# EAGLE design TelosDebugBoard (EAGLE 5.10)
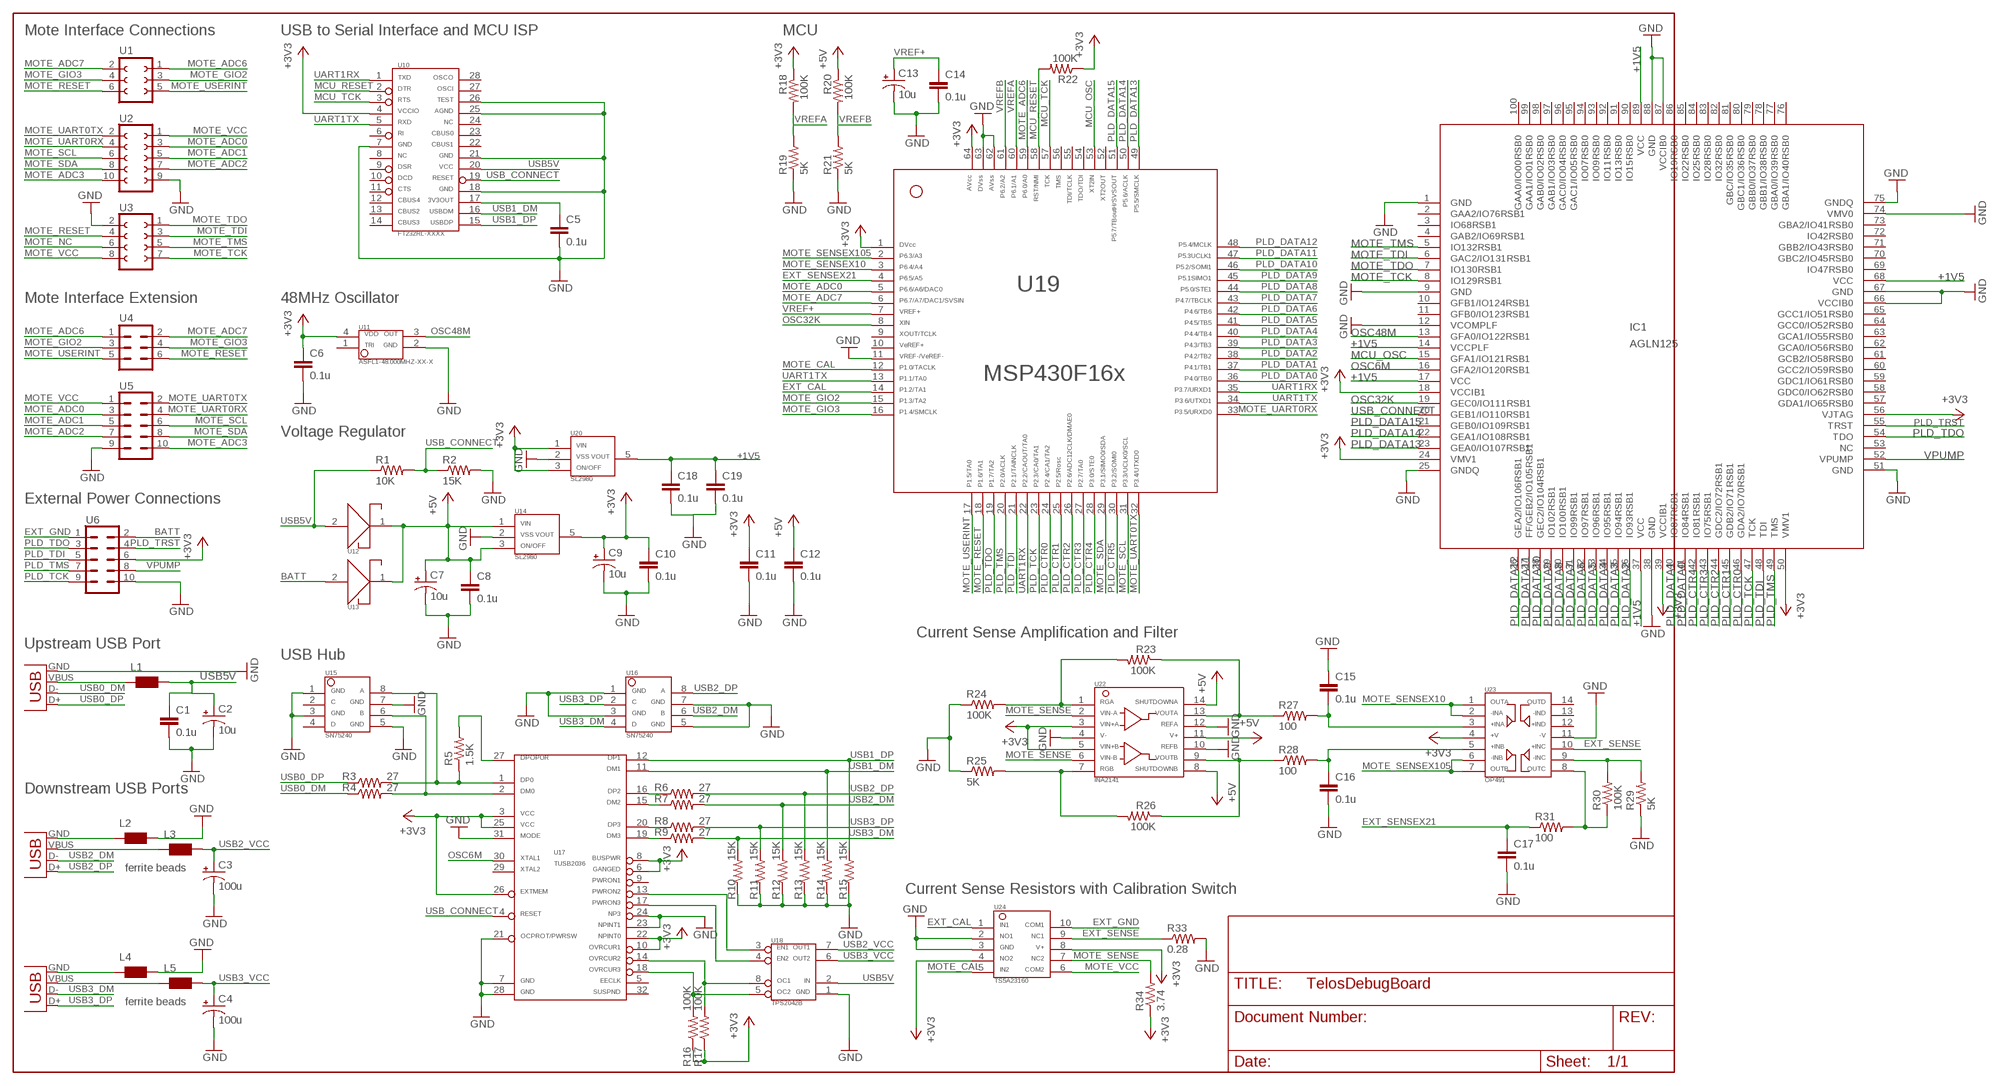
[diagram p0: schematic, sheet 1]

## Parts
C1  0.1u  C-EUC0603  [C0603]
C2  10u  CPOL-USCT6032  [CT6032]
C3  100u  CPOL-USCT7343  [CT7343]
C4  100u  CPOL-USCT7343  [CT7343]
C5  0.1u  C-EUC0603  [C0603]
C6  0.1u  C-EUC0603  [C0603]
C7  10u  CPOL-USCT6032  [CT6032]
C8  0.1u  C-EUC0603  [C0603]
C9  10u  CPOL-USCT6032  [CT6032]
C10  0.1u  C-EUC0603  [C0603]
C11  0.1u  C-EUC0603  [C0603]
C12  0.1u  C-EUC0603  [C0603]
C13  10u  CPOL-USCT6032  [CT6032]
C14  0.1u  C-EUC0603  [C0603]
C15  0.1u  C-EUC0603  [C0603]
C16  0.1u  C-EUC0603  [C0603]
C17  0.1u  C-EUC0603  [C0603]
C18  0.1u  C-EUC0603  [C0603]
C19  0.1u  C-EUC0603  [C0603]
IC1  AGLN125  [VQ100]
L1  WE-CBF_0805  [0805]
L2  WE-CBF_0805  [0805]
L3  WE-CBF_0805  [0805]
L4  WE-CBF_0805  [0805]
L5  WE-CBF_0805  [0805]
R1  10K  R-US_R0603  [R0603]
R2  15K  R-US_R0402  [R0402]
R3  27  R-US_R0402  [R0402]
R4  27  R-US_R0402  [R0402]
R5  1.5K  R-US_R0402  [R0402]
R6  27  R-US_R0402  [R0402]
R7  27  R-US_R0402  [R0402]
R8  27  R-US_R0402  [R0402]
R9  27  R-US_R0402  [R0402]
R10  15K  R-US_R0402  [R0402]
R11  15K  R-US_R0402  [R0402]
R12  15K  R-US_R0402  [R0402]
R13  15K  R-US_R0402  [R0402]
R14  15K  R-US_R0402  [R0402]
R15  15K  R-US_R0402  [R0402]
R16  100K  R-US_R0603  [R0603]
R17  100K  R-US_R0603  [R0603]
R18  100K  R-US_R0603  [R0603]
R19  5K  R-US_R0603  [R0603]
R20  100K  R-US_R0603  [R0603]
R21  5K  R-US_R0603  [R0603]
R22  100K  R-US_R0603  [R0603]
R23  100K  R-US_R0603  [R0603]
R24  100K  R-US_R0603  [R0603]
R25  5K  R-US_R0603  [R0603]
R26  100K  R-US_R0603  [R0603]
R27  100  R-US_R0402  [R0402]
R28  100  R-US_R0402  [R0402]
R29  5K  R-US_R0603  [R0603]
R30  100K  R-US_R0603  [R0603]
R31  100  R-US_R0402  [R0402]
R33  0.28  R-US_R0805  [R0805]
R34  3.74  R-US_R1206  [R1206]
U1  HEADER-3X2-RECEPTICAL  [HEADER-3X2-RECEPTICAL]
U2  HEADER-5X2-RECEPTICAL  [HEADER-5X2-RECEPTICAL]
U3  HEADER-4X2-RECEPTICAL  [HEADER-4X2-RECEPTICAL]
U4  HEADER-3X2-PLUG  [HEADER-3X2-PLUG]
U5  HEADER-5X2-PLUG  [HEADER-5X2-PLUG]
U6  HEADER-5X2-PLUG  [HEADER-5X2-PLUG]
U7  USB-TYPEA-PLUG  [USB-TYPEA-PLUG]
U8  USB-TYPEA-RECEPTICAL  [USB-TYPEA-RECEPTICAL]
U9  USB-TYPEA-RECEPTICAL  [USB-TYPEA-RECEPTICAL]
U10  FT2232RL  [SSOP28]
U11  ASFL1-48.000MHZ-EK-T  [ASFXX-XX.XXXMHZ-XX-X]
U12  PMEG2010AEH  [SOD123F]
U13  PMEG2010AEH  [SOD123F]
U14  SL2980  [SOT-23-5]
U15  SN75240PW  [PW8]
U16  SN75240PW  [PW8]
U17  TUSB2036VF  [VF32]
U18  TPS2042BD  [D8]
U19  MSP430  F16X---PM64  [PM/PAG64]
U20  SL2980  [SOT-23-5]
U22  INA2331  [PW14]
U23  OP491  OPT491  [TSSOP14]
U24  TS5A23160  [DGS10]

## Nets
+1V5: C18.1 C19.1 IC1.14(VCCPLF) IC1.17(VCC) IC1.37(VCC) IC1.68(VCC) IC1.89(VCC) U20.5
+3V3: C6.1 C9.+ C10.1 C11.1 IC1.18(VCCIB1) IC1.24(VMV1) IC1.39(VCCIB1) IC1.50(VMV1) IC1.56(VJTAG) R16.1 R17.1 R18.1 R22.1 R34.1 U6.6 U10.4 U11.4 U14.5 U17.3 U17.6 U17.8 U17.10 U17.22 U17.25 U17.26 U19.1 U19.64 U20.1 U20.3 U22.3 U22.5 U23.4 U24.4 U24.8
+5V: C7.+ C8.1 C12.1 R20.1 U12.1 U13.1 U14.1 U14.3 U22.8 U22.11 U22.14
BATT: U6.2 U13.2
EXT_CAL: U19.14 U24.1
EXT_GND: U6.1 U24.10
EXT_SENSE: R33.1 U23.10 U24.9
EXT_SENSEX21: C17.1 R31.1 U19.4
GND: C1.2 C2.- C3.- C4.- C5.2 C6.2 C7.- C8.2 C9.- C10.2 C11.2 C12.2 C13.- C14.2 C15.1 C16.2 C17.2 C18.2 C19.2 IC1.1(GND) IC1.9(GND) IC1.12(VCOMPLF) IC1.25(GNDQ) IC1.38(GND) IC1.51(GND) IC1.66(VCCIB0) IC1.67(GND) IC1.74(VMV0) IC1.75(GNDQ) IC1.87(VCCIB0) IC1.88(GND) L2.2 L4.2 R2.2 R10.1 R11.1 R12.1 R13.1 R14.1 R15.1 R19.1 R21.1 R24.1 R25.1 R29.1 R33.2 U2.9 U3.2 U5.9 U6.10 U7.GND U10.7 U10.18 U10.21 U10.25 U10.26 U11.2 U14.2 U15.1 U15.3 U15.5 U15.7 U16.1 U16.3 U16.5 U16.7 U17.7 U17.21 U17.23 U17.24 U17.28 U17.31 U18.1 U19.11 U19.62 U19.63 U20.2 U22.4 U22.10 U22.12 U23.11 U24.2 U24.3
MCU_OSC: IC1.15(GFA1/IO121RSB1) U19.53
MCU_RESET: R22.2 U10.2 U19.58
MCU_TCK: U10.3 U19.57
MOTE_ADC0: U2.3 U5.3 U19.5
MOTE_ADC1: U2.5 U5.5
MOTE_ADC2: U2.7 U5.7
MOTE_ADC3: U2.10 U5.10
MOTE_ADC6: U1.1 U4.1 U19.59
MOTE_ADC7: U1.2 U4.2 U19.6
MOTE_CAL: U19.12 U24.5
MOTE_GIO2: U1.3 U4.3 U19.15
MOTE_GIO3: U1.4 U4.4 U19.16
MOTE_NC: U3.6
MOTE_RESET: U1.6 U3.4 U4.6 U19.18
MOTE_SCL: U2.6 U5.6 U19.31
MOTE_SDA: U2.8 U5.8 U19.29
MOTE_SENSE: R34.2 U22.2 U22.6 U24.7
MOTE_SENSEX10: U19.3 U23.1 U23.2
MOTE_SENSEX105: U19.2 U23.6 U23.7
MOTE_TCK: IC1.8(IO129RSB1) U3.7
MOTE_TDI: IC1.6(GAC2/IO131RSB1) U3.3
MOTE_TDO: IC1.7(IO130RSB1) U3.1
MOTE_TMS: IC1.5(IO132RSB1) U3.5
MOTE_UART0RX: U2.4 U5.4 U19.33
MOTE_UART0TX: U2.2 U5.2 U19.32
MOTE_USERINT: U1.5 U4.5 U19.17
MOTE_VCC: U2.1 U3.8 U5.1 U24.6
N$1: C5.1 U10.17
N$2: L1.1 U7.VBUS
N$4: L2.1 U8.GND
N$5: L3.1 U8.VBUS
N$6: L4.1 U9.GND
N$7: U17.13 U18.3
N$8: L5.1 U9.VBUS
N$11: U17.17 U18.4
N$12: R17.2 U17.14 U18.8
N$13: R16.2 U17.18 U18.5
N$20: R5.2 U17.27
N$21: R3.2 R5.1 U15.8 U17.1
N$22: R25.2 R26.2 U22.7
N$23: R23.2 R24.2 U22.1
N$24: R29.2 R30.2 U23.9
N$25: R30.1 R31.2 U23.8
N$26: R4.2 U15.6 U17.2
N$27: C15.2 R27.2 U23.3
N$28: C16.1 R28.2 U23.5
N$29: R6.1 U17.16
N$30: R7.1 U17.15
N$31: R8.1 U17.20
N$32: R9.1 U17.19
OSC6M: IC1.16(GFA2/IO120RSB1) U17.30
OSC32K: IC1.19(GEC0/IO111RSB1) U19.8
OSC48M: IC1.13(GFA0/IO122RSB1) U11.3
PLD_CTR0: IC1.46(GDA2/IO70RSB1) U19.24
PLD_CTR1: IC1.45(GDB2/IO71RSB1) U19.25
PLD_CTR2: IC1.44(GDC2/IO72RSB1) U19.26
PLD_CTR3: IC1.43(IO75RSB1) U19.27
PLD_CTR4: IC1.42(IO81RSB1) U19.28
PLD_CTR5: U19.30
PLD_DATA0: IC1.41(IO84RSB1) U19.36
PLD_DATA1: IC1.40(IO87RSB1) U19.37
PLD_DATA2: IC1.36(IO93RSB1) U19.38
PLD_DATA3: IC1.35(IO94RSB1) U19.39
PLD_DATA4: IC1.34(IO95RSB1) U19.40
PLD_DATA5: IC1.33(IO96RSB1) U19.41
PLD_DATA6: IC1.32(IO97RSB1) U19.42
PLD_DATA7: IC1.31(IO99RSB1) U19.43
PLD_DATA8: IC1.30(IO100RSB1) U19.44
PLD_DATA9: IC1.29(IO102RSB1) U19.45
PLD_DATA10: IC1.28(GEC2/IO104RSB1) U19.46
PLD_DATA11: IC1.27(FF/GEB2/IO105RSB1) U19.47
PLD_DATA12: IC1.26(GEA2/IO106RSB1) U19.48
PLD_DATA13: IC1.23(GEA0/IO107RSB1) U19.49
PLD_DATA14: IC1.22(GEA1/IO108RSB1) U19.50
PLD_DATA15: IC1.21(GEB0/IO109RSB1) U19.51
PLD_TCK: IC1.47(TCK) U6.9 U19.23
PLD_TDI: IC1.48(TDI) U6.5 U19.21
PLD_TDO: IC1.54(TDO) U6.3 U19.19
PLD_TMS: IC1.49(TMS) U6.7 U19.20
PLD_TRST: IC1.55(TRST) U6.4
UART1RX: U10.1 U19.22 U19.35
UART1TX: U10.5 U19.13 U19.34
USB0_DM: R4.1 U7.D-
USB0_DP: R3.1 U7.D+
USB1_DM: R14.2 U10.16 U17.11
USB1_DP: R15.2 U10.15 U17.12
USB2_DM: R7.2 R12.2 U8.D- U16.6
USB2_DP: R6.2 R13.2 U8.D+ U16.8
USB2_VCC: C3.+ L3.2 U18.7
USB3_DM: R9.2 R10.2 U9.D- U16.4
USB3_DP: R8.2 R11.2 U9.D+ U16.2
USB3_VCC: C4.+ L5.2 U18.6
USB5V: C1.1 C2.+ L1.2 R1.1 U10.20 U12.2 U18.2
USB_CONNECT: IC1.20(GEB1/IO110RSB1) R1.2 R2.1 U10.19 U17.4
VOUTA: R23.1 R27.1 U22.13
VOUTB: R26.1 R28.1 U22.9
VPUMP: IC1.52(VPUMP) U6.8
VREF+: C13.+ C14.1 U19.7
VREFA: R18.2 R19.2 U19.60
VREFB: R20.2 R21.2 U19.61
Unconnected: IC1.2(GAA2/IO76RSB1) IC1.3(IO68RSB1) IC1.4(GAB2/IO69RSB1) IC1.10(GFB1/IO124RSB1) IC1.11(GFB0/IO123RSB1) IC1.53(NC) IC1.57(GDA1/IO65RSB0) IC1.58(GDC0/IO62RSB0) IC1.59(GDC1/IO61RSB0) IC1.60(GCC2/IO59RSB0) IC1.62(GCA0/IO56RSB0) IC1.64(GCC0/IO52RSB0) IC1.65(GCC1/IO51RSB0) IC1.69(IO47RSB0) IC1.70(GBC2/IO45RSB0) IC1.71(GBB2/IO43RSB0) IC1.72(IO42RSB0) IC1.73(GBA2/IO41RSB0) IC1.76(GBA1/IO40RSB0) IC1.77(GBA0/IO39RSB0) IC1.78(GBB1/IO38RSB0) IC1.79(GBB0/IO37RSB0) IC1.80(GBC1/IO36RSB0) IC1.81(GBC/IO35RSB0) IC1.82(IO32RSB0) IC1.83(IO28RSB0) IC1.84(IO25RSB0) IC1.85(IO22RSB0) IC1.86(IO19RSB0) IC1.90(IO15RSB0) IC1.91(IO13RSB0) IC1.92(IO11RSB0) IC1.93(IO09RSB0) IC1.94(IO07RSB0) IC1.95(GAC1/IO05RSB0) IC1.96(GAC0/IO04RSB0) IC1.97(GAB1/IO03RSB0) IC1.98(GAB0/IO02RSB0) IC1.99(GAA1/IO01RSB0) IC1.100(GAA0/IO00RSB0) U10.6 U10.8 U10.9 U10.10 U10.11 U10.12 U10.13 U10.14 U10.22 U10.23 U10.24 U10.27 U10.28 U11.1 U15.2 U15.4 U17.5 U17.9 U17.29 U17.32 U19.9 U19.10 U19.52 U19.54 U19.55 U19.56 U23.12 U23.13 U23.14

## Notes on the sheet
- Mote Interface Connections | USB to Serial Interface and MCU ISP | MCU
- Mote Interface Extension | 48MHz Oscillator
- Voltage Regulator
- External Power Connections
- Current Sense Amplification and Filter
- Upstream USB Port
- USB Hub
- Downstream USB Ports
- ferrite beads
- Current Sense Resistors with Calibration Switch
- ferrite beads

## Power pins joined to a net without a drawn wire
GCA1/IO55RSB0: IC1.63(GCA1/IO55RSB0)
GCB2/IO58RSB0: IC1.61(GCB2/IO58RSB0)

## Library data of the parts
C1 C5 C6 C8 C10-C12 C14-C19 = rcl:C-EU: CAPACITOR, European symbol
C2-C4 C7 C9 C13 = rcl:CPOL-US: POLARIZED CAPACITOR, American symbol
IC1 = MATT_ACTEL:AGLN125: Igloo nano FPGA from Actel.
L1-L5 = wuerth-elektronik:WE-CBF: SMD EMI Suppression Ferrite Beads - excellent anti-EMI properties - low DCR - impedances till 3000 ohms - rated current up to 6 A
R1-R31 R33 R34 = resistor:R-US_: RESISTOR, American symbol
U1 = TDB:HEADER-3X2-RECEPTICAL
U2 = TDB:HEADER-5X2-RECEPTICAL: FEMALE HEADER
U3 = TDB:HEADER-4X2-RECEPTICAL: Header receptical 2mm spacing
U4 = TDB:HEADER-3X2-PLUG: PIN HEADER
U5 U6 = TDB:HEADER-5X2-PLUG: PIN HEADER
U7 = TDB:USB-TYPEA-PLUG
U8 U9 = TDB:USB-TYPEA-RECEPTICAL
U10 = TDBRevC:FT2232RL: Future Technology Devices (FTDI) FT232RL USB UART IC. In SSOP28 packege.
U11 = TDBRevC:ASFL1-48.000MHZ-EK-T: 48MHz crystal clock oscillator.
U12 U13 = TDBRevC:PMEG2010AEH: Schottky diode/rectifier.
U14 U20 = TDB:SL2980: LDO voltage regulator
U15 U16 = TDB:SN75240PW: USB port transient suppressor
U17 = TDB:TUSB2036VF: USB hub
U18 = TDB:TPS2042BD: Current-limited, power-distribution switch for USB
U19 = TI_MSP430_v13:F16X---PM64: *** MSP430F16x *** PM64
U22 = TDB:INA2331: Dual instumentation amplifier
U23 = TDB:OPT491: Quad op amp with input overvoltage protection
U24 = TDB:TS5A23160: TI: Dual SPDT analog switch.

## Board
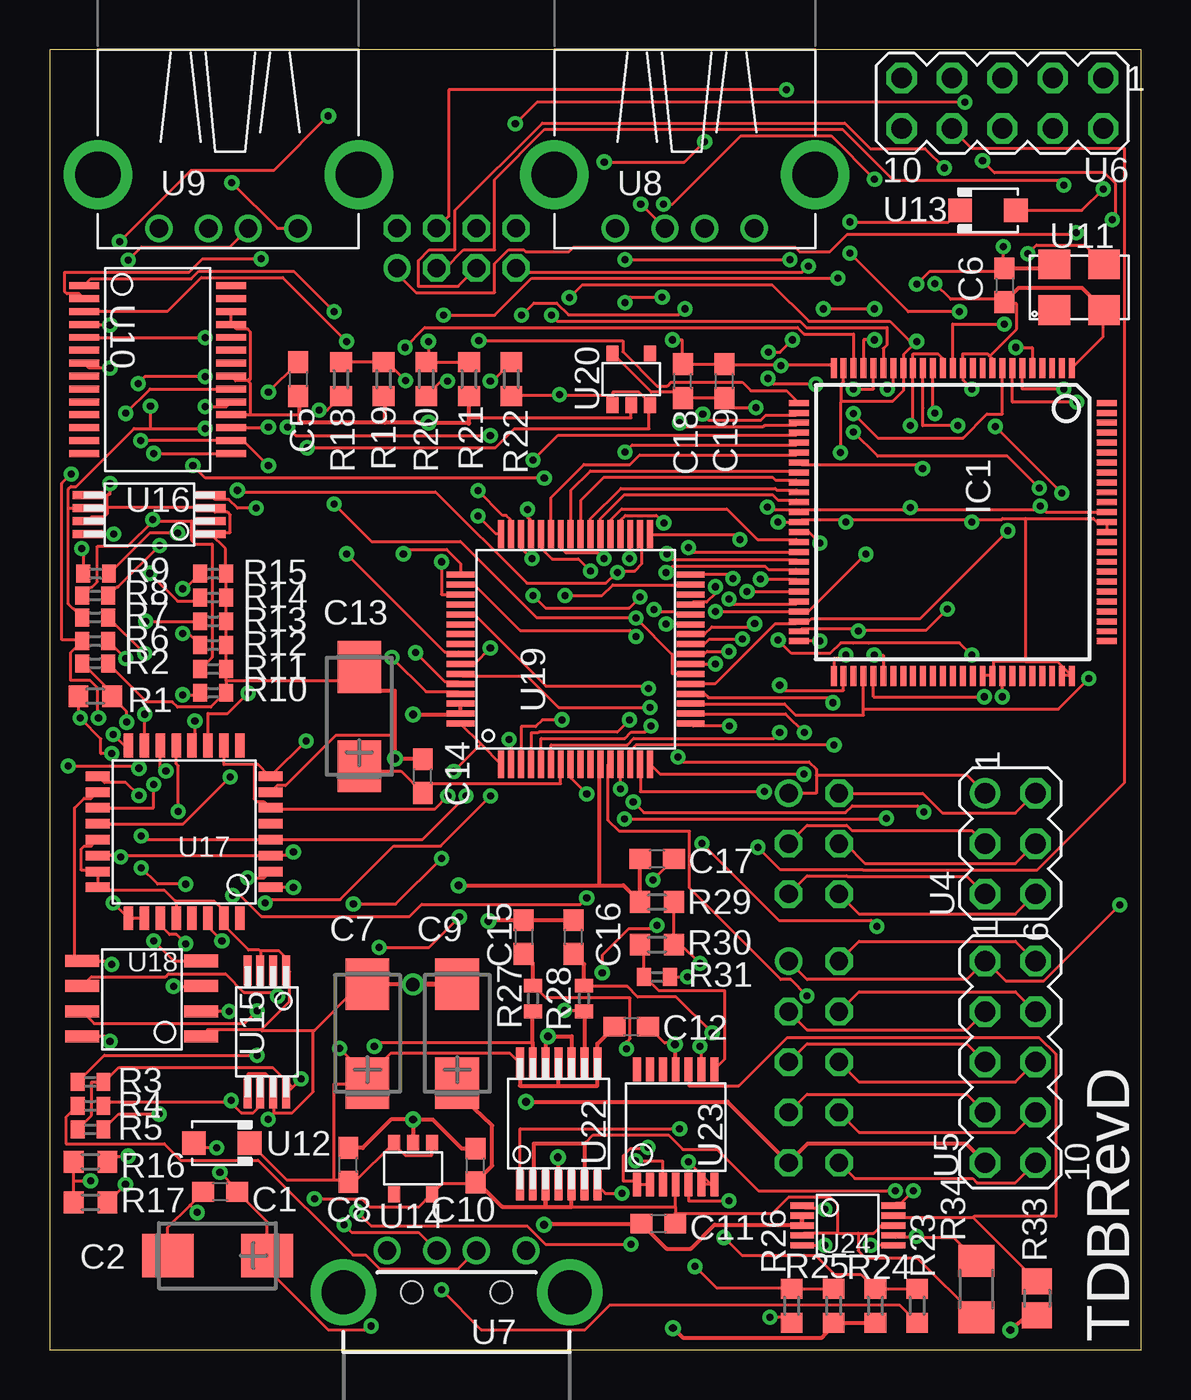
[diagram p1: board, top side]
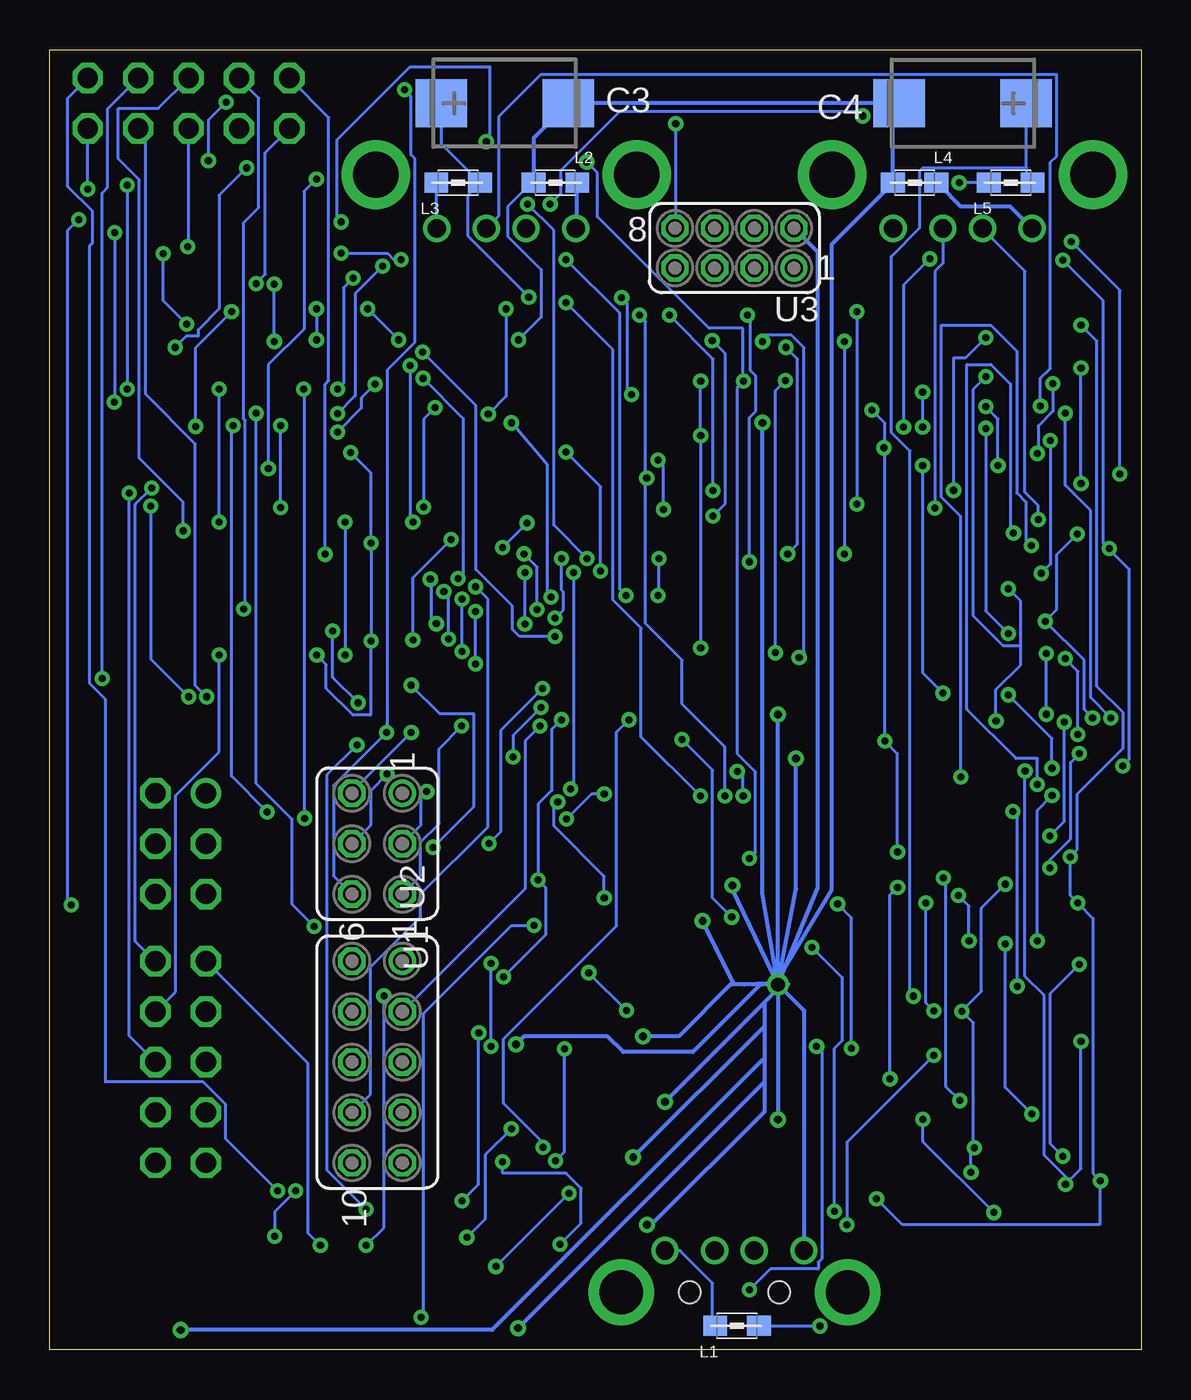
[diagram p2: board, bottom side, seen from below]

Size 55 x 65.5 mm. Coordinates in mm from the lower left corner, seen from the top.
Outline: 0,0 55,0 55,65.5 0,65.5 0,0
Copper layers (1*16): Top 0.0178mm / dielectric 1.4986mm / Bottom 0.0178mm
Design rules "SSC-EAGLE-2Lyr_v1.0.0.3": minimum track width 6mil, minimum drill 14mil, track to track 6mil, track to pad 6mil, pad to pad 6mil, via to via 6mil, smd to smd 6mil, copper to edge 20mil, drill to drill 16mil, minimum pad ring 8mil, minimum via ring 8mil, stop-mask expansion 3mil, vias tented up to drill 0mil, thermal gap 10mil

### Footprints (pad centres in the part's own frame; a part is rotated, then mirrored left to right if it is on the bottom)
C0603 = smd 1.1 x 1: 1 -0.85,0; 2 0.85,0
CT6032 = smd 2.6 x 2.2: + -2.5,0; - 2.5,0
CT7343 = smd 2.6 x 2.4: + -3.2,0; - 3.2,0
VQ100 = smd 1 x 0.3: 1 -7.75,6; 2 -7.75,5.5; 3 -7.75,5; 4 -7.75,4.5; 5 -7.75,4; 6 -7.75,3.5; 7 -7.75,3; 8 -7.75,2.5; 9 -7.75,2; 10 -7.75,1.5; 11 -7.75,1; 12 -7.75,0.5; 13 -7.75,0; 14 -7.75,-0.5; 15 -7.75,-1; 16 -7.75,-1.5; 17 -7.75,-2; 18 -7.75,-2.5; 19 -7.75,-3; 20 -7.75,-3.5; 21 -7.75,-4; 22 -7.75,-4.5; 23 -7.75,-5; 24 -7.75,-5.5; 25 -7.75,-6; 51 7.75,-6; 52 7.75,-5.5; 53 7.75,-5; 54 7.75,-4.5; 55 7.75,-4; 56 7.75,-3.5; 57 7.75,-3; 58 7.75,-2.5; 59 7.75,-2; 60 7.75,-1.5; 61 7.75,-1; 62 7.75,-0.5; 63 7.75,0; 64 7.75,0.5; 65 7.75,1; 66 7.75,1.5; 67 7.75,2; 68 7.75,2.5; 69 7.75,3; 70 7.75,3.5; 71 7.75,4; 72 7.75,4.5; 73 7.75,5; 74 7.75,5.5; 75 7.75,6 | smd 0.3 x 1: 26 -6,-7.75; 27 -5.5,-7.75; 28 -5,-7.75; 29 -4.5,-7.75; 30 -4,-7.75; 31 -3.5,-7.75; 32 -3,-7.75; 33 -2.5,-7.75; 34 -2,-7.75; 35 -1.5,-7.75; 36 -1,-7.75; 37 -0.5,-7.75; 38 0,-7.75; 39 0.5,-7.75; 40 1,-7.75; 41 1.5,-7.75; 42 2,-7.75; 43 2.5,-7.75; 44 3,-7.75; 45 3.5,-7.75; 46 4,-7.75; 47 4.5,-7.75; 48 5,-7.75; 49 5.5,-7.75; 50 6,-7.75; 76 6,7.75; 77 5.5,7.75; 78 5,7.75; 79 4.5,7.75; 80 4,7.75; 81 3.5,7.75; 82 3,7.75; 83 2.5,7.75; 84 2,7.75; 85 1.5,7.75; 86 1,7.75; 87 0.5,7.75; 88 0,7.75; 89 -0.5,7.75; 90 -1,7.75; 91 -1.5,7.75; 92 -2,7.75; 93 -2.5,7.75; 94 -3,7.75; 95 -3.5,7.75; 96 -4,7.75; 97 -4.5,7.75; 98 -5,7.75; 99 -5.5,7.75; 100 -6,7.75
0805 = smd 1.2 x 1: 1 -1.1,0; 2 1.1,0
R0603 = smd 1 x 1.1: 1 -0.85,0; 2 0.85,0
R0402 = smd 0.7 x 0.9: 1 -0.65,0; 2 0.65,0
R0805 = smd 1.3 x 1.5: 1 -0.85,0; 2 0.85,0
R1206 = smd 1.6 x 1.803: 1 -1.422,0; 2 1.422,0
HEADER-3X2-RECEPTICAL = drill 0.914 round: 1 -2.54,1.27 | drill 0.914 octagon: 2 -2.54,-1.27; 3 0,1.27; 4 0,-1.27; 5 2.54,1.27; 6 2.54,-1.27
HEADER-5X2-RECEPTICAL = drill 0.914 round: 1 -5.08,1.27 | drill 0.914 octagon: 2 -5.08,-1.27; 3 -2.54,1.27; 4 -2.54,-1.27; 5 0,1.27; 6 0,-1.27; 7 2.54,1.27; 8 2.54,-1.27; 9 5.08,1.27; 10 5.08,-1.27
HEADER-4X2-RECEPTICAL = drill 0.914 round: 1 -3,1 | drill 0.914 octagon: 2 -3,-1; 3 -1,1; 4 -1,-1; 5 1,1; 6 1,-1; 7 3,1; 8 3,-1
HEADER-3X2-PLUG = drill 1.016 round: 1 -2.54,-1.27 | drill 1.016 octagon: 2 -2.54,1.27; 3 0,-1.27; 4 0,1.27; 5 2.54,-1.27; 6 2.54,1.27
HEADER-5X2-PLUG = drill 1.016 octagon: 1 -5.08,-1.27; 2 -5.08,1.27; 3 -2.54,-1.27; 4 -2.54,1.27; 5 0,-1.27; 6 0,1.27; 7 2.54,-1.27; 8 2.54,1.27; 9 5.08,-1.27; 10 5.08,1.27
USB-TYPEA-PLUG = drill 0.92 round: D+ 2.1,1; D- 2.1,-1; GND 2.1,3.5; VBUS 2.1,-3.5 | drill 2.2 round: GND@1 0,5.7; GND@2 0,-5.7 | hole 1.1: 0,2.25; 0,-2.25
USB-TYPEA-RECEPTICAL = drill 0.92 round: D+ 2.71,-1; D- 2.71,1; GND 2.71,-3.5; VBUS 2.71,3.5 | drill 2.3 round: GND@1 0,6.57; GND@2 0,-6.57
SSOP28 = smd 1.5 x 0.35: 1 -3.7,4.225; 2 -3.7,3.575; 3 -3.7,2.925; 4 -3.7,2.275; 5 -3.7,1.625; 6 -3.7,0.975; 7 -3.7,0.325; 8 -3.7,-0.325; 9 -3.7,-0.975; 10 -3.7,-1.625; 11 -3.7,-2.275; 12 -3.7,-2.925; 13 -3.7,-3.575; 14 -3.7,-4.225; 15 3.7,-4.225; 16 3.7,-3.575; 17 3.7,-2.925; 18 3.7,-2.275; 19 3.7,-1.625; 20 3.7,-0.975; 21 3.7,-0.325; 22 3.7,0.325; 23 3.7,0.975; 24 3.7,1.625; 25 3.7,2.275; 26 3.7,2.925; 27 3.7,3.575; 28 3.7,4.225
ASFXX-XX.XXXMHZ-XX-X = smd 1.6 x 1.5: 1 -1.25,-1.15; 2 1.25,-1.15; 3 1.25,1.15; 4 -1.25,1.15
SOD123F = smd 1.2 x 1.2: 1 -1.4,0; 2 1.4,0
SOT-23-5 = smd 0.6 x 0.8: 1 -0.95,-1.3; 2 0,-1.3; 3 0.95,-1.3; 4 0.95,1.3; 5 -0.95,1.3
PW8 = smd 0.4 x 1.5: 1 -0.975,-3.1; 2 -0.325,-3.1; 3 0.325,-3.1; 4 0.975,-3.1; 5 0.975,3.1; 6 0.325,3.1; 7 -0.325,3.1; 8 -0.975,3.1
VF32 = smd 0.48 x 1.2: 1 -2.8,-4.35; 2 -2,-4.35; 3 -1.2,-4.35; 4 -0.4,-4.35; 5 0.4,-4.35; 6 1.2,-4.35; 7 2,-4.35; 8 2.8,-4.35; 17 2.8,4.35; 18 2,4.35; 19 1.2,4.35; 20 0.4,4.35; 21 -0.4,4.35; 22 -1.2,4.35; 23 -2,4.35; 24 -2.8,4.35 | smd 1.2 x 0.48: 9 4.35,-2.8; 10 4.35,-2; 11 4.35,-1.2; 12 4.35,-0.4; 13 4.35,0.4; 14 4.35,1.2; 15 4.35,2; 16 4.35,2.8; 25 -4.35,2.8; 26 -4.35,2; 27 -4.35,1.2; 28 -4.35,0.4; 29 -4.35,-0.4; 30 -4.35,-1.2; 31 -4.35,-2; 32 -4.35,-2.8
D8 = smd 0.6 x 1.7: 1 -1.905,-3; 2 -0.635,-3; 3 0.635,-3; 5 1.905,3; 6 0.635,3; 7 -0.635,3; 8 -1.905,3 | smd 0.66 x 1.7: 4 1.905,-3
PM/PAG64 = smd 1.4 x 0.3: 1 -5.8,3.75; 2 -5.8,3.25; 3 -5.8,2.75; 4 -5.8,2.25; 5 -5.8,1.75; 6 -5.8,1.25; 7 -5.8,0.75; 8 -5.8,0.25; 9 -5.8,-0.25; 10 -5.8,-0.75; 11 -5.8,-1.25; 12 -5.8,-1.75; 13 -5.8,-2.25; 14 -5.8,-2.75; 15 -5.8,-3.25; 16 -5.8,-3.75; 33 5.8,-3.75; 34 5.8,-3.25; 35 5.8,-2.75; 36 5.8,-2.25; 37 5.8,-1.75; 38 5.8,-1.25; 39 5.8,-0.75; 40 5.8,-0.25; 41 5.8,0.25; 42 5.8,0.75; 43 5.8,1.25; 44 5.8,1.75; 45 5.8,2.25; 46 5.8,2.75; 47 5.8,3.25; 48 5.8,3.75 | smd 0.3 x 1.4: 17 -3.75,-5.8; 18 -3.25,-5.8; 19 -2.75,-5.8; 20 -2.25,-5.8; 21 -1.75,-5.8; 22 -1.25,-5.8; 23 -0.75,-5.8; 24 -0.25,-5.8; 25 0.25,-5.8; 26 0.75,-5.8; 27 1.25,-5.8; 28 1.75,-5.8; 29 2.25,-5.8; 30 2.75,-5.8; 31 3.25,-5.8; 32 3.75,-5.8; 49 3.75,5.8; 50 3.25,5.8; 51 2.75,5.8; 52 2.25,5.8; 53 1.75,5.8; 54 1.25,5.8; 55 0.75,5.8; 56 0.25,5.8; 57 -0.25,5.8; 58 -0.75,5.8; 59 -1.25,5.8; 60 -1.75,5.8; 61 -2.25,5.8; 62 -2.75,5.8; 63 -3.25,5.8; 64 -3.75,5.8
PW14 = smd 0.4 x 1.5: 1 -1.95,-3.1; 2 -1.3,-3.1; 3 -0.65,-3.1; 4 0,-3.1; 5 0.65,-3.1; 6 1.3,-3.1; 7 1.95,-3.1; 8 1.95,3.1; 9 1.3,3.1; 10 0.65,3.1; 11 0,3.1; 12 -0.65,3.1; 13 -1.3,3.1; 14 -1.95,3.1
TSSOP14 = smd 0.4 x 1.2: 1 -1.95,-2.9; 2 -1.3,-2.9; 3 -0.65,-2.9; 4 0,-2.9; 5 0.65,-2.9; 6 1.3,-2.9; 7 1.95,-2.9; 8 1.95,2.9; 9 1.3,2.9; 10 0.65,2.9; 11 0,2.9; 12 -0.65,2.9; 13 -1.3,2.9; 14 -1.95,2.9
DGS10 = smd 0.32 x 1.2: 1 -1,-2.3; 2 -0.5,-2.3; 3 0,-2.3; 4 0.5,-2.3; 5 1,-2.3; 6 1,2.3; 7 0.5,2.3; 8 0,2.3; 9 -0.5,2.3; 10 -1,2.3

### Placement (x,y rotation side)
C1  8.59,7.97 180 top
C2  8.46,4.75 180 top
C3  32.07,62.8 0 bottom
C4  9,62.8 180 bottom
C5  12.52,48.9 270 top
C6  48.1,53.63 270 top
C7  16.01,15.93 90 top
C8  15.05,9.32 90 top
C9  20.53,15.93 90 top
C10  21.46,9.29 90 top
C11  30.67,6.36 180 top
C12  29.3,16.28 0 top
C13  15.6,31.9 90 top
C14  18.8,28.9 90 top
C15  23.88,20.8 270 top
C16  26.4,20.8 90 top
C17  30.6,24.73 180 top
C18  31.9,48.8 90 top
C19  34,48.8 90 top
IC1  45.5,41.7 270 top
L1  20.37,1.21 0 bottom
L2  29.52,58.8 180 bottom
L3  34.42,58.8 0 bottom
L4  11.42,58.8 180 bottom
L5  6.58,58.8 0 bottom
R1  2.3,32.93 0 top
R2  2.3,34.58 0 top
R3  2.06,13.5 0 top
R4  2.06,12.3 0 top
R5  2.06,11.11 0 top
R6  2.3,35.7 180 top
R7  2.3,36.9 180 top
R8  2.3,38 180 top
R9  2.34,39.1 180 top
R10  8.24,33.1 180 top
R11  8.24,34.3 180 top
R12  8.24,35.5 180 top
R13  8.24,36.7 180 top
R14  8.24,37.9 180 top
R15  8.24,39.1 180 top
R16  2.06,9.48 0 top
R17  2.06,7.43 0 top
R18  14.68,48.9 90 top
R19  16.83,48.9 90 top
R20  18.98,48.9 90 top
R21  21.13,48.9 90 top
R22  23.26,48.9 90 top
R23  43.7,2.22 90 top
R24  41.6,2.22 90 top
R25  39.5,2.22 90 top
R26  37.38,2.22 90 top
R27  24.35,17.7 90 top
R28  26.93,17.7 90 top
R29  30.6,22.56 0 top
R30  30.6,20.41 0 top
R31  30.6,18.78 180 top
R33  49.74,2.6 270 top
R34  46.68,3.07 90 top
U1  38.5,25.5 270 bottom
U2  38.5,14.5 270 bottom
U3  20.5,55.5 180 bottom
U4  48.4,25.5 270 top
U5  48.4,14.5 270 top
U6  48,62.8 180 top
U7  20.5,2.9 90 top
U8  32,59.2 270 top
U9  9,59.2 270 top
U10  5.44,49.38 0 top
U11  51.87,53.53 0 top
U12  8.67,10.42 180 top
U13  47.27,57.4 0 top
U14  18.31,9.14 180 top
U15  10.94,16.02 180 top
U16  5.02,42.08 90 top
U17  6.78,26.1 90 top
U18  4.64,17.69 90 top
U19  26.5,35.3 90 top
U20  29.3,48.9 0 top
U22  25.64,11.39 0 top
U23  31.54,11.23 0 top
U24  40.21,6.27 270 top

### Tracks (layer width: path | path; a pad name or v marks a point on that pad's centre or on a via)
+1V5  (via drill 0.36)
  Top 0.152: U20.5 30.32,48.24 31.62,48.24 C18.1 31.96,47.96 33.9,47.96 C19.1 33.96,47.92 34.42,47.46 v35.58,47.46 | IC1.14 45,49.94 44.76,50.18 43.5,50.18 IC1.17 43.48,49.38 43.48,46.56 v43.36,46.56 | v48,32.9 IC1.68 | IC1.89 50.2,42.2 v49.9,42.5 49.98,42.32 43.36,42.32 | 43.36,42.32 37.88,42.32 IC1.37 37.78,42.32 36.3,42.32 v36.16,42.46 | 43.36,42.32 v43.36,42.44
  Bottom 0.152: v48,32.9 49.9,34.8 v49.9,42.5 | v43.36,42.44 v43.36,46.56 | v35.58,47.46 36.16,46.88 v36.16,42.46
+3V3  (via drill 0.36)
  Top 0.152: v48.04,55.58 48.04,54.56 C6.1 48.02,54.42 47.94,54.34 44.34,54.34 v43.68,53.68 | 39.88,47.78 39.88,48.66 40,48.78 IC1.24 | 39.88,47.78 42.46,47.78 43,48.32 IC1.18 43.02,49.52 43.02,50.14 v43.68,50.8 43.46,50.68 42.32,51.82 38.24,51.82 36.4,53.66 26.84,53.66 v26.18,53 | v38.8,40.64 38.24,41.2 IC1.39 | v38.8,35.7 IC1.50 | v41.54,35 42,35 IC1.56 | v39.84,45.2 39.84,47.72 39.88,47.78 | 28.36,48.06 28.36,48.24 29.7,48.24 30.24,47.7 U20.3 30.2,47.54 30.2,46.4 23.42,46.4 22.46,45.44 v12.98,45.44 | 28.36,48.06 U20.1 | 25.68,48.06 R22.1 | 28.36,48.06 25.68,48.06 | 21.73,30.51 U19.64 | 21.73,30.51 U19.1 | v13.58,47.34 13.98,47.34 R18.1 | v12.92,30.68 U17.8 11.06,28.92 10.5,29.48 10.3,29.48 | 10.3,29.48 8.78,29.48 U17.10 | 10.3,29.48 10.3,27.76 10.44,27.62 10.8,27.62 U17.6 11.18,27.26 19.42,27.26 v20.06,27.9 | v20.36,29.14 21.73,30.51 | 25.68,48.06 v25.68,48.12 | C10.1 21.38,8.38 19.8,8.38 U14.5 19.2,7.8 18.6,7.2 16.12,7.2 15.72,7.6 v13.34,7.6 | 31.52,7.2 31.52,8.32 U23.4 | 31.52,7.2 31.52,6.88 | 31.52,6.88 C11.1 | 26.29,7.2 31.52,7.2 | 40.74,5.88 41.52,5.88 41.9,6.26 U24.8 | 39.68,5.88 40.74,5.88 | 39.68,5.88 38.02,5.88 U24.4 | R34.1 43.7,4.64 41.1,4.64 40.74,5 40.74,5.88 | 31.52,6.88 36.42,6.88 37.24,7.7 39.32,7.7 39.68,7.34 39.68,5.88 | 1.22,8.52 R16.1 | 1.22,8.52 R17.1 | U17.26 U17.25 3.92,21.8 v3.2,22.52 | 3.58,24.9 U17.22 | 3.58,24.9 U17.3 11.2,24.92 12.12,24.92 v12.28,25.08 | v3.58,24.84 3.58,24.9 | v3.04,51.62 1.76,51.62 U10.4 | 1.22,8.52 v2.06,8.52
  Top 0.2: 25,7.2 U22.3 24.99,7.21 | 25,7.2 26.29,7.2 U22.5 | 24.99,7.21 25,7.2 | 24.99,7.21 22.8,7.21 21.57,8.44 C10.1 22.3,9.28 22.3,11.3 20.53,12.97 C9.+ | C6.1 50.42,54.48 U11.4
  Bottom 0.152: v48.04,55.58 48,55.62 U6.6 | v41.54,35 41.06,34.52 41.06,33.32 39.72,31.98 38.84,31.98 38.84,35.64 v38.8,35.7 v38.8,40.64 38.84,40.7 38.84,44.2 v39.84,45.2 | v43.68,50.8 v43.68,53.68 | v13.58,47.34 12.92,46.68 12.92,45.44 | 12.92,45.44 v12.92,30.68 12.88,30.62 12.28,30.02 v12.28,25.08 | v20.36,29.14 20.06,28.84 v20.06,27.9 | 12.92,45.44 v12.98,45.44 | v26.18,53 25.9,52.72 25.9,48.34 v25.68,48.12 | v3.04,51.62 2.24,50.82 2.24,33.42 0.92,32.1 0.92,30.32 3.24,28 3.24,25.2 3.54,24.9 v3.58,24.84 3.58,22.9 v3.2,22.52 3.16,22.46 2.42,21.72 2.42,8.88 v2.06,8.52 2.1,8.46 2.1,6.3 12.04,6.3 v13.34,7.6
+5V  (via drill 0.36)
  Top 0.152: U14.1 19.26,9.8 17.9,9.8 17.36,10.34 U14.3 15.4,8.48 C8.1 14.98,8.5 14.92,8.56 14.32,8.56 | 14.32,8.56 11.94,8.56 U12.1 | v20.04,48.8 19.72,48.8 R20.1 | v19.74,24.76 17.44,22.46 v15.3,22.46 | v14.6,15.18 16,13.78 C7.+ | v40.32,56.82 45.28,56.82 U13.1 | v33,60.86 31.98,59.84 v27.94,59.84 | U22.14 23.6,14.54 23.18,14.96 17.2,14.96 16.06,13.82 C7.+ | 14.32,8.56 14.32,13.4 15.94,13.4 C7.+
  Top 0.2: U22.14 23.69,13.3 25.64,13.3 | 25.64,13.3 U22.11 | 25.64,13.3 27.59,13.3 U22.8 27.59,15.42 C12.1
  Bottom 0.152: v19.74,24.76 19.44,25.06 19.44,29.1 20.36,30.02 20.36,48.48 v20.04,48.8 20.08,48.86 20.08,51.46 21.78,51.46 27.4,57.08 27.4,59.3 v27.94,59.84 | v15.3,22.46 14.6,21.76 v14.6,15.18 | v40.32,56.82 40.54,57.04 40.54,60.94 36.86,64.62 32.8,64.62 32.8,61.06 v33,60.86
BATT  (via drill 0.36)
  Top 0.152: v53.08,58.48 52,57.4 U13.2
  Bottom 0.152: v53.08,58.48 U6.2
EXT_CAL  (via drill 0.36)
  Top 0.152: v39.06,7.08 38.98,7.16 38.02,7.16 U24.1 | v39.52,30.48 29.54,30.48 29.26,30.2 U19.14
  Bottom 0.152: v39.06,7.08 41.02,9.04 41.02,28.98 v39.52,30.48
EXT_GND  (via drill 0.36)
  Top 0.152: v43.52,8.02 42.9,7.4 42.64,7.4 U24.10
  Bottom 0.152: v43.52,8.02 46.12,10.62 46.12,12.36 47.26,13.5 52.18,13.5 52.18,32.76 52.98,33.56 52.98,55.62 52.84,55.76 52.84,57.36 54.08,58.6 54.08,63.06 U6.1
EXT_SENSE
  Top 0.152: 46.54,6.66 42.62,6.66 U24.9 | 46.54,6.66 R33.1 | U23.10 32.2,13.3 34.72,13.3 37.16,15.74 49.84,15.74 50.68,14.9 50.68,6.72 46.58,6.72 46.54,6.66
EXT_SENSEX21  (via drill 0.36)
  Top 0.152: R31.1 v32.14,18.78 | v30.4,23.68 C17.1 | v29.22,31.74 28.6,31.12 24.64,31.12 24.6,31.08 24.26,31.08 U19.4
  Bottom 0.152: v32.14,18.78 29.98,20.94 29.98,23.26 v30.4,23.68 30.36,23.74 30.36,27.52 29.68,28.2 29.68,31.28 v29.22,31.74
GND  (via drill 0.36, 0.4, 0.7)
  Top 0.152: IC1.66 IC1.67 47.54,34.02 47.54,34.68 49.16,34.68 | IC1.74 IC1.75 51.42,34.02 50.76,34.68 49.16,34.68 | 46.46,41.82 47.96,41.82 48.02,41.88 49.16,41.88 | 40.12,41.82 46.46,41.82 | 40.12,41.82 37.88,41.82 IC1.38 v36.7,41.7 | 49.16,41.88 52.58,41.88 52.76,41.7 IC1.88 53.26,41.64 IC1.87 | v40.12,35 39.94,34.82 39.5,34.82 IC1.51 | 40.12,41.82 v40.12,41.7 | 49.16,41.88 49.16,34.68 | 47.37,50.07 47.5,49.94 IC1.9 | 47.37,50.07 47.26,50.18 46,50.18 IC1.12 46.02,49.38 46.02,48.84 v46.46,48.4 | IC1.1 53.06,51.02 53.06,52.3 U11.2 | 47.37,50.07 48.72,51.42 48.72,52.7 48.16,52.7 C6.2 48.1,52.92 45.4,52.92 v44.6,53.72 | 46.46,41.82 v46.46,41.7 | 7.07,7.29 5.96,6.18 C2.- | 7.07,7.29 C1.2 | U17.21 2.1,25.38 1.74,25.38 1.6,25.24 1.6,24.16 2.4,24.16 U17.23 U17.24 2.5,23.26 2.62,23.14 5.8,23.14 6.32,22.62 6.38,22.58 | 6.38,22.58 8.32,22.58 8.78,22.12 U17.31 8.8,21.68 8.8,21.22 8.94,21.22 10.02,20.14 10.56,20.14 10.62,20.1 | 6.38,22.58 U17.28 | U15.5 9.98,12.92 9.98,13.9 10.92,13.9 11.26,13.56 U15.7 11.3,12.86 11.3,11.94 | 10.62,20.1 U15.3 | 10.62,20.1 11.56,20.1 11.9,19.76 U15.1 11.96,19.06 12.1,19.06 12.1,17.56 10.66,16.12 | 10.66,16.12 7.96,16.12 7.64,15.8 U18.1 | 11.3,11.94 12.22,11.94 13.28,13 13.28,16.06 | 13.28,16.06 10.7,16.06 10.66,16.12 | v11,11.62 11.26,11.88 11.3,11.94 | 7.07,7.29 v7.44,6.92 | 2.9,42.44 2.9,43.04 | 2.9,42.44 2.9,42.1 2.76,41.96 2.12,41.96 U16.7 | 2.9,43.04 1.92,43.04 U16.5 | v3.04,49.46 1.98,49.46 U10.7 | v3.04,43.64 3.04,43.1 2.94,43.1 2.9,43.04 | 8.9,33.7 R11.1 8.9,34.36 R12.1 8.9,35.56 R13.1 8.9,36.76 R14.1 8.9,37.96 R15.1 8.86,39.16 8.86,40.36 U16.1 8.14,41.18 9.1,41.18 9.1,42.06 8.96,42.2 8.32,42.2 U16.3 8.06,42.44 2.9,42.44
  Top 0.152: 8.9,33.7 R10.1 8.82,33.08 8.12,32.38 6.44,32.38 6.18,32.64 4.9,32.64 R2.2 | 36.84,49.64 33.9,49.64 C19.2 33.84,49.66 C18.2 31.86,49.72 31.86,50.88 v31.38,50.88 | 36.84,49.64 39.32,49.64 IC1.25 | U10.26 U10.25 9.2,51.62 9.4,51.42 9.98,51.42 10.12,51.28 10.12,48.88 10.02,48.88 9.98,48.82 | U20.2 29.3,46.96 21.13,46.96 | C12.2 30.98,15.46 31.42,15.46 v31.5,15.4 | U17.7 11.46,28.42 11.88,28.42 14.4,30.94 17.4,30.94 | 10.12,47.1 U10.18 | 12.6,47.1 10.12,47.1 | 9.98,48.82 9.36,48.82 U10.21 | 9.98,48.82 10.12,48.68 10.12,47.1 | 8.9,33.7 15.52,33.7 C13.- | 13.28,16.06 13.34,16.1 15.44,18.2 15.74,18.2 C7.- | 36.84,49.64 v36.84,49.58
  Top 0.2: C9.- C7.- 15.83,18.25 | v18.3,11.6 v18.31,11.6 U14.2 | C8.2 15.77,10.17 17.2,11.6 v18.3,11.6 | C10.2 20.76,10.14 19.3,11.6 v18.3,11.6 | C9.- 18.3,18.43 v18.3,18.4 | C9.- 18.43,18.43 18.4,18.4 v18.3,18.4 | v18.3,18.4 20.3,18.4 | U22.12 24.99,15.59 v25.1,15.8 26.3,15.8 U22.10 | C16.2 C15.1 22.2,21.65 v22.1,21.6 | C6.2 48.82,53.5 52,53.5 U11.2 | R33.2 49.24,1.7 v48.4,1 | R24.1 R25.1 39.45,1.25 38.9,0.61 31.9,0.61 v31.4,1.1 | U23.11 31.5,14.23 v31.5,15.4 | U24.3 U24.2 37.9,6.3 33.5,6.3 32.3,5.1 31.08,5.1 C11.2 25.26,6.36 v24.9,6.3 | U5.9 46.15,10.4 38.2,10.4 U2.9 34.15,12.5 v24,12.5 | R29.1 29.25,23.06 | R29.1 28.91,23.4 27.7,23.4 | v20.6,23.4 27.7,23.4 | U19.62 U19.63 20.7,32 v18.3,32 | U19.11 27.7,29.5 27.7,23.4 | R29.1 C17.2 | U22.4 25.6,8.33 v25.6,9.7 | C5.2 12.6,47.97 12.6,47.1 12.6,46.7 16.9,46.7 | R19.1 16.9,48.05 16.9,46.7 | 21.13,46.7 21.13,46.96 R21.1 | C13.- 15.6,33.2 17.4,33.2 17.4,30.94 v17.4,29.8 18.8,29.8 C14.2 | 21.13,46.7 v19.1,46.7 16.9,46.7 | 21.13,46.7 21.13,46.66
  Bottom 0.152: v40.12,41.7 v40.12,35 | v44.6,53.72 44.14,54.18 44.14,60.3 U6.10 | v46.46,41.7 v46.46,48.4 | v7.44,6.92 11,10.48 v11,11.62 | v3.04,43.64 v3.04,49.46 | v31.38,50.88 30.24,52.02 30.24,54.42 31.92,56.1 31.92,57.6 30.7,58.82 L2.2 | v36.7,41.7 36.84,41.84 v36.84,49.58
  Bottom 0.2: 18.3,18.2 v18.3,11.6 | 19.4,18.43 18.83,18.43 19.1,18.4 | U7.GND 17,17.1 v18.3,18.4 | L2.2 30.62,61.04 C3.- C4.- 12.52,61.98 L4.2 12.52,58.78 15.6,55.7 15.6,23.2 18.4,18.5 v18.3,18.4 | v18.3,18.4 17.8,18.43 | v18.3,18.4 20.6,23.2 v20.6,23.4 | v18.3,18.4 19.1,18.4 | 19.2,18.4 20,18.4 | 20,18.4 20.7,18.4 23.3,15.8 v25.1,15.8 | v22.1,21.6 20.85,19.07 C9.- 20,18.4 | U3.2 16.3,55.3 16.3,23.3 v18.3,18.4 | v48.4,1 32.7,1 19.1,14.6 19,14.6 | v18.3,18.4 18.3,18.2 | v31.5,15.4 31.1,15.8 26.9,15.8 26.1,15 22.6,15 19.2,18.4 | 19.1,18.4 19.2,18.4 | 24.8,6.3 v24.9,6.3 24.7,6.3 19,12 19,13.5 | 18.3,18.2 19,17.5 | 19,14.6 19,13.5 | 19,13.5 v31.4,1.1 | 19,16.3 19,14.6 | 19,17.5 v24,12.5 | 19,16.3 v25.6,9.7 | 19,17.5 19,16.3 | v17.4,29.8 17.4,23.2 v18.3,18.4 | v18.3,18.4 v18.3,32 | v19.1,46.7 19.1,23 v18.3,18.4
MCU_OSC  (via drill 0.36)
  Top 0.152: v44.6,47.18 44.5,47.18 IC1.15 | v41.68,21.34 41.38,21.64 36.74,21.64 v32.86,25.52 | v30.16,33.32 30.04,33.44 25,33.44 21.4,37.04 U19.53
  Bottom 0.152: v44.6,47.18 44.6,28.54 42.78,26.72 42.78,22.44 v41.68,21.34 | v32.86,25.52 32.28,26.1 32.28,31.2 v30.16,33.32
MCU_RESET  (via drill 0.36)
  Top 0.152: v22.2,48.8 22.32,48.8 R22.2 | v22.2,35.36 21.4,34.56 U19.58 | v10.66,54.96 7.7,54.96 7.02,54.28 0.76,54.28 0.76,53.32 0.88,53.2 1.5,53.2 U10.2 | v11.98,46.48 12.4,46.06 v22.2,46.06
  Bottom 0.152: v22.2,35.36 v22.2,46.06 v22.2,48.8 | v10.66,54.96 11.98,53.64 v11.98,46.48
MCU_TCK  (via drill 0.36)
  Top 0.152: v14.96,40.1 19.9,35.16 20.6,35.16 U19.57 | v14.96,50.8 11.74,54.02 7.64,54.02 5.94,52.32 1.74,52.32 U10.3
  Bottom 0.152: v14.96,50.8 v14.96,40.1
MOTE_ADC0  (via drill 0.36)
  Top 0.152: v30.3,31.42 30,31.12 29.3,31.12 28.98,30.8 24.76,30.8 U19.5 | U5.3 46.2,16.12 38.16,16.12 U2.3
  Bottom 0.152: v30.3,31.42 31.04,30.68 31.04,23.22 U2.3
MOTE_ADC1
  Top 0.152: U2.5 38.16,15.42 46.2,15.42 U5.5
MOTE_ADC2
  Top 0.152: U2.7 38.16,12.88 46.2,12.88 U5.7
MOTE_ADC3
  Top 0.152: U2.10 40.56,8.64 46.5,8.64 46.72,8.42 48.66,8.42 U5.10
MOTE_ADC6  (via drill 0.36)
  Top 0.152: v30.24,32.36 25.64,32.36 24.06,33.94 20.8,33.94 U19.59 | v31.66,29.86 31.9,29.62 38.26,29.62 38.62,29.26 38.62,28.96 | 38.62,28.96 38.62,28.04 U1.1 | U4.1 46.2,28.96 38.62,28.96
  Bottom 0.152: v30.24,32.36 31.66,30.94 v31.66,29.86
MOTE_ADC7  (via drill 0.36)
  Top 0.152: v36.78,31.1 36.48,30.8 29.42,30.8 29.1,30.48 25.26,30.48 U19.6 | U4.2 48.66,27.04 44.98,27.04 43.98,28.04 U1.2
  Bottom 0.152: v36.78,31.1 39.76,28.12 U1.2
MOTE_CAL  (via drill 0.36)
  Top 0.152: v39.06,5.26 U24.5 | v38.16,17.84 37.34,18.66 36.84,18.66 32.24,23.26 32.24,26.12 28.7,26.12 28.14,26.68 28.14,29.5 U19.12
  Bottom 0.152: v39.06,5.26 38.16,6.16 v38.16,17.84
MOTE_GIO2  (via drill 0.36)
  Top 0.152: v36,28.12 29.76,28.12 U19.15 | U4.3 46.46,26.16 40.42,26.16 40.16,26.42 38.16,26.42 U1.3
  Bottom 0.152: v36,28.12 36.3,27.82 36.3,26.42 U1.3
MOTE_GIO3  (via drill 0.36)
  Top 0.152: v38,29 30.76,29 U19.16 | U4.4 48.66,24.5 41.08,24.5 40.08,25.5 U1.4
  Bottom 0.152: v38,29 38.84,28.16 38.84,26.42 U1.4
MOTE_RESET  (via drill 0.36)
  Top 0.152: v38.02,31.1 37.08,32.04 U19.18 | U3.4 20.1,57.1 20.1,63.48 v37.12,63.48 | U4.6 48.66,21.96 40.78,21.96 U1.6
  Bottom 0.152: U1.6 40.7,23.88 40.7,28.42 v38.02,31.1 37.98,31.16 37.98,49.38 36.6,50.76 36.6,60 36.8,60.2 36.8,63.16 v37.12,63.48
MOTE_SCL  (via drill 0.36)
  Top 0.152: v25.96,38 27.84,38 28.38,38.54 U19.31 | v28.98,54.92 29,54.9 37.28,54.9 v37.3,54.92 | v40.32,55.24 43.26,52.3 v45.84,52.3 | v51,43.16 v47.64,46.52 | U2.6 40.78,13.5 48.66,13.5 U5.6
  Bottom 0.152: v25.96,38 26.3,38.34 26.3,52.24 v28.98,54.92 | v37.3,54.92 37.66,54.92 37.98,55.24 v40.32,55.24 | v45.84,52.3 47.64,50.5 v47.64,46.52 | v51,43.16 51,15.82 U5.6
MOTE_SDA  (via drill 0.36)
  Top 0.152: v33.54,38.44 33.54,38.1 33.1,37.66 32.4,37.66 U19.29 | U5.8 48.66,10.96 40.78,10.96 U2.8
  Bottom 0.152: v33.54,38.44 32.92,37.82 32.92,26.34 36.3,22.96 36.3,21.82 38.84,19.28 38.84,12.88 U2.8
MOTE_SENSE  (via drill 0.36)
  Top 0.152: 43.66,5.66 45.52,5.66 R34.2 | 43.66,5.66 42.62,5.66 U24.7 | v42.6,8.02 35.7,8.02 33.62,10.1 31.9,10.1 31.18,10.82 27.38,10.82 27.02,10.46 26.94,10.4 | v43.66,5.72 43.66,5.66
  Top 0.2: U22.2 24.4,8.35 24.4,10.4 26.94,10.4 U22.6
  Bottom 0.152: v42.6,8.02 43.66,6.96 v43.66,5.72
MOTE_SENSEX10  (via drill 0.36)
  Top 0.152: U23.2 U23.1 29.52,8.36 29.38,8.5 28.9,8.5 28.9,9.78 29.26,10.14 30.08,10.14 v30.14,10.2 | v25.82,31.74 24.82,31.74 24.48,31.4 23.76,31.4 U19.3
  Bottom 0.152: v25.82,31.74 26.44,31.12 26.44,21.36 32.14,15.66 32.14,12.42 30.14,10.42 v30.14,10.2
MOTE_SENSEX105  (via drill 0.36)
  Top 0.152: 33.26,8.34 U23.7 | 33.26,8.34 U23.6 | v23.14,30.74 23.24,30.74 U19.2 | v20.64,21.8 19.12,20.28 v16.6,20.28 | v15.46,6.98 16.2,6.24 24.06,6.24 24.98,5.32 v29.28,5.32 | v32.18,9.48 33.26,8.4 33.26,8.34
  Bottom 0.152: v23.14,30.74 21.6,29.2 21.6,22.76 v20.64,21.8 | v16.6,20.28 15.06,18.74 15.06,15.6 15.46,15.2 v15.46,6.98 | v29.28,5.32 28.22,6.38 28.22,8.14 28.98,8.9 32.18,8.9 v32.18,9.48
MOTE_TCK  (via drill 0.36)
  Top 0.152: v40.5,47.16 41.72,45.94 46.02,45.94 47.22,47.14 48,47.14 IC1.8 | v38.22,54.6 37.92,54.3 23.7,54.3 U3.7
  Bottom 0.152: v40.5,47.16 39.6,48.06 39.6,53.22 v38.22,54.6
MOTE_TDI  (via drill 0.36)
  Top 0.152: v51.1,48.4 49,48.4 IC1.6 | v51.1,58.68 50.86,58.92 42.5,58.92 39.94,61.48 24.94,61.48 22.42,58.96 22.42,55.42 20.86,55.42 19.94,54.5 U3.3
  Bottom 0.152: v51.1,58.68 v51.1,48.4
MOTE_TDO  (via drill 0.36)
  Top 0.152: v51.74,47.74 48.5,47.74 IC1.7 | v51.72,56.28 51.64,56.2 40.18,56.2 39.3,55.32 37.78,55.32 37.56,55.54 26.38,55.54 26.16,55.32 23.98,55.32 23.88,55.42 23.12,55.42 22.42,54.72 22.42,53.26 18.46,53.26 17.5,54.22 U3.1
  Bottom 0.152: v51.74,47.74 51.72,47.76 v51.72,56.28
MOTE_TMS  (via drill 0.36)
  Top 0.152: v48.68,50.5 49.5,50.5 IC1.5 | v45.08,59.54 44.1,60.52 41.34,60.52 40.06,61.8 24.82,61.8 20.42,57.4 20.42,55.42 19.12,55.42 18.58,54.88 18.58,53.58 20.58,53.58 U3.5
  Bottom 0.152: v48.68,50.5 48.12,51.06 47.52,51.06 47.52,51.38 46.46,52.44 46.46,58.16 v45.08,59.54
MOTE_UART0RX  (via drill 0.36)
  Top 0.152: v34.78,40.82 34.56,41.04 30.32,41.04 U19.33 | v36.7,35.76 37.38,35.08 39.32,35.08 39.86,35.62 40.46,35.62 40.48,35.6 41.26,35.6 41.28,35.62 45.84,35.62 v46.46,35 | U2.4 40.78,18.04 48.66,18.04 U5.4
  Bottom 0.152: v34.78,40.82 36.7,38.9 v36.7,35.76 | v46.46,35 46.46,30.12 48.66,27.92 48.66,18.04 U5.4
MOTE_UART0TX  (via drill 0.36)
  Top 0.152: v34.42,38.86 34.22,39.06 U19.32 | v36.18,48.94 36.48,48.64 v38.6,48.64 | v40.5,46.24 41.72,45.02 48.26,45.02 v49.86,43.42 | U2.2 40.78,20.58 48.66,20.58 U5.2
  Bottom 0.152: v34.42,38.86 34.16,39.12 34.16,46.92 v36.18,48.94 | v38.6,48.64 39.28,47.96 39.28,47.46 v40.5,46.24 | v49.86,43.42 50.68,42.6 50.68,20.58 U5.2
MOTE_USERINT  (via drill 0.36)
  Top 0.152: v34.24,31.42 32.42,31.42 U19.17 | U4.5 46.22,23.86 40.18,23.86 40.16,23.88 38.16,23.88 U1.5
  Bottom 0.152: v34.24,31.42 35.38,30.28 35.38,26.5 36.3,25.58 36.3,23.88 U1.5
MOTE_VCC  (via drill 0.36)
  Top 0.152: v41.36,5.26 U24.6 | U2.1 38.16,18.66 46.2,18.66 U5.1 47.2,19.56 48.18,18.58 50.08,18.58 v53.92,22.42 | v23.46,61.76 24.56,62.86 v46.1,62.86 | v47,59.9 47.6,59.3 53.14,59.3 53.7,58.74 53.7,56.94 v53.54,56.94
  Bottom 0.152: v41.36,5.26 41.98,5.88 41.98,14.44 U5.1 | U3.8 23.46,56.54 v23.46,61.76 | v46.1,62.86 47,61.96 v47,59.9 | v53.54,56.94 54.08,56.4 54.08,22.58 v53.92,22.42
N$1  (via drill 0.36)
  Top 0.152: v11.02,48.24 C5.1 | v11.02,46.48 11,46.46 U10.17
  Bottom 0.152: v11.02,46.48 v11.02,48.24
N$2
  Bottom 0.152: U7.VBUS 23.24,5 21.6,3.36 21.6,1.34 L1.1
N$4
  Bottom 0.152: 28.42,56.5 U8.GND
  Bottom 0.2: 28.42,56.47 28.42,56.5 L2.1
N$5
  Bottom 0.152: L3.1 35.5,58.78 U8.VBUS
N$6
  Bottom 0.2: U9.GND 6.61,57.6 9.1,57.6 10.16,58.66 L4.1
N$7  (via drill 0.36)
  Top 0.152: v6.48,27.12 6.48,29.42 6.38,29.52 U17.13 | v6.24,18.32 U18.3
  Bottom 0.152: v6.48,27.12 6.24,26.88 v6.24,18.32
N$8  (via drill 0.36)
  Top 0.152: v9.18,58.8 11.48,56.5 U9.VBUS
  Bottom 0.152: L5.1 v9.18,58.8
N$11  (via drill 0.36)
  Top 0.152: v4.5,27.92 3.84,28.58 2.76,28.58 U17.17 | v5.24,20.6 6.24,19.6 U18.4
  Bottom 0.152: v4.5,27.92 5.24,27.18 v5.24,20.6
N$12  (via drill 0.36)
  Top 0.152: v3.04,15.54 2.8,15.78 U18.8 | R17.2 v3.82,8.34 | v5.86,29.16 5.58,29.16 U17.14
  Bottom 0.152: v3.04,15.54 3.04,9.12 v3.82,8.34 3.68,8.58 4.9,9.8 4.9,17.86 5.86,18.82 v5.86,29.16
N$13  (via drill 0.36)
  Top 0.152: v3.96,9.76 3.2,9.76 R16.2 | v3.12,19.42 2.96,19.58 1.64,19.58 U18.5 1.6,19.66 1.26,19.66 1.26,27.3 1.74,27.78 2.1,27.78 U17.18
  Bottom 0.152: v3.96,9.76 4.58,10.38 4.58,17.96 v3.12,19.42
N$20  (via drill 0.36)
  Top 0.152: v5.52,11.88 3.48,11.88 R5.2 | v6.86,20.46 6.4,20.92 6.04,20.92 5.58,21.38 U17.27
  Bottom 0.152: v5.52,11.88 6.86,13.22 v6.86,20.46
N$21  (via drill 0.36)
  Top 0.152: R5.1 2.12,11.82 2.12,13.5 R3.2 2.78,13.52 3.48,14.22 11.24,14.22 12.23,13.23 | 12.23,13.23 U15.8 | 12.23,13.23 v12.66,13.66 | v12.28,23.3 U17.1
  Bottom 0.152: v12.28,23.3 12.66,22.92 v12.66,13.66
N$22  (via drill 0.36)
  Top 0.152: R25.2 R26.2 37.32,3.12 33.6,3.12 v32.52,4.2 | v28.84,7.88 28,7.88 U22.7
  Bottom 0.152: v28.84,7.88 v32.52,4.2
N$23  (via drill 0.36)
  Top 0.152: R23.2 R24.2 41.54,3.12 40.86,3.8 39.54,3.8 38.58,4.76 34.88,4.76 v33.98,5.66 | v31.74,11.14 23.7,11.14 U22.1
  Bottom 0.152: v31.74,11.14 33.06,9.82 33.06,6.58 v33.98,5.66
N$24  (via drill 0.36)
  Top 0.152: R29.2 R30.2 31.52,20.38 31.84,20.38 v32.76,19.46 | v32.76,15.28 32.84,15.28 U23.9
  Bottom 0.152: v32.76,15.28 v32.76,19.46
N$25
  Top 0.152: R30.1 29.94,20.4 R31.2 30.02,18.76 30.68,18.1 34,18.1 34,14.64 U23.8
N$26  (via drill 0.36)
  Top 0.152: 9.1,12.5 2.92,12.5 R4.2 | 9.1,12.5 9.66,11.94 10.26,11.94 10.6,12.28 U15.6 | v9.98,23.78 10.8,23.78 U17.2 | 9.1,12.5 v9.14,12.56
  Bottom 0.152: v9.98,23.78 9.84,23.64 9.84,13.26 v9.14,12.56
N$27  (via drill 0.36)
  Top 0.152: v29.52,9.52 30.88,9.52 U23.3 | v29.06,15.16 29.06,15.54 29.1,15.54 29.24,15.68 29.24,17.72 25.02,17.72 24.44,18.3 R27.2
  Top 0.2: R27.2 24.35,19.48 C15.2
  Bottom 0.152: v29.52,9.52 29.06,9.98 v29.06,15.16
N$28  (via drill 0.36)
  Top 0.152: v34.22,7.5 32.2,7.5 U23.5 | v33.38,15.96 31.56,17.78 29.62,17.78 29.1,18.3 27.02,18.3 R28.2
  Top 0.2: R28.2 26.93,19.42 C16.1
  Bottom 0.152: v34.22,7.5 33.38,8.34 v33.38,15.96
N$29  (via drill 0.36)
  Top 0.152: v3.84,34.82 R6.1 | v3.2,31 3.74,30.46 U17.16
  Bottom 0.152: v3.84,34.82 3.2,34.18 v3.2,31
N$30  (via drill 0.36)
  Top 0.152: v4.78,35.08 R7.1 | U17.15 v4.78,32.02
  Bottom 0.152: v4.78,32.02 v4.78,35.08
N$31  (via drill 0.36)
  Top 0.152: v5.54,40.52 3.44,38.42 3.38,38.42 R8.1 | v9.1,28.86 6.74,26.5 U17.20
  Bottom 0.152: v5.54,40.52 5.82,40.8 5.82,42.72 6.28,43.18 6.28,50.32 7.58,51.62 10.08,51.62 10.08,42.96 9.1,41.98 v9.1,28.86
N$32  (via drill 0.36)
  Top 0.152: v6.44,41.14 5.04,41.14 R9.1 | v5.24,28.48 5.24,27.3 U17.19
  Bottom 0.152: v6.44,41.14 6.6,41.3 6.6,48.66 7.58,49.64 8.78,49.64 8.78,32.26 6.3,29.78 5.24,29.78 v5.24,28.48
OSC6M  (via drill 0.36)
  Top 0.152: v45.76,46.56 43.98,46.56 43.98,47.44 44,47.46 IC1.16 | v44.04,27.1 43.74,27.4 40.44,27.4 40.1,27.06 29.94,27.06 v29.4,27.6 | v27.06,22.76 26.74,22.44 18.74,22.44 18.14,21.84 10.66,21.84 9.6,22.9 v9.22,22.9 | v8.68,20.6 7.98,21.3 U17.30
  Bottom 0.152: v45.76,46.56 45.84,46.48 45.84,28.9 v44.04,27.1 | v29.4,27.6 29.58,27.42 29.58,26.38 27.06,23.86 v27.06,22.76 | v9.22,22.9 8.68,22.36 v8.68,20.6
OSC32K  (via drill 0.36)
  Top 0.152: v42.2,48.4 42.5,48.4 IC1.19 | v42.16,26.78 42.12,26.74 v28.96,26.74 | v27.06,28 26.26,28.8 U19.8
  Bottom 0.152: v42.2,48.4 42.16,48.36 v42.16,26.78 | v28.96,26.74 27.7,28 v27.06,28
OSC48M  (via drill 0.36)
  Top 0.152: v48.1,51.68 45.5,51.68 IC1.13 | v49.28,55.22 49.72,55.66 52.14,55.66 U11.3
  Bottom 0.152: v48.1,51.68 49.28,52.86 v49.28,55.22
PLD_CTR0  (via drill 0.36)
  Top 0.152: v34.22,37.82 34.46,37.58 37.62,37.58 IC1.46 | v34.22,35.18 33.12,35.18 33,35.06 U19.24
  Bottom 0.152: v34.22,35.18 v34.22,37.82
PLD_CTR1  (via drill 0.36)
  Top 0.152: v34.9,35.8 33.24,35.8 33,35.56 U19.25 | v35.14,38.2 IC1.45
  Bottom 0.152: v35.14,38.2 34.9,37.96 v34.9,35.8
PLD_CTR2  (via drill 0.36)
  Top 0.152: v35.82,38.82 37.62,38.82 IC1.44 | v35.52,36.58 35.36,36.42 33.36,36.42 33,36.06 U19.26
  Bottom 0.152: v35.82,38.82 35.76,38.76 35.76,36.82 v35.52,36.58
PLD_CTR3  (via drill 0.36)
  Top 0.152: v31.06,39.16 31.38,39.48 36.04,39.48 36.2,39.32 37.62,39.32 IC1.43 | v31.06,36.56 U19.27
  Bottom 0.152: v31.06,36.56 v31.06,39.16
PLD_CTR4  (via drill 0.36)
  Top 0.152: v31.1,40.1 31.4,39.8 37.64,39.8 IC1.42 | v30.44,37.3 30.56,37.18 31.48,37.18 31.6,37.06 U19.28
  Bottom 0.152: v31.1,40.1 30.44,39.44 v30.44,37.3
PLD_DATA0  (via drill 0.36)
  Top 0.152: v32.18,40.42 32.4,40.2 IC1.41 | v30.94,41.66 30.56,42.04 29,42.04 28.76,41.8 U19.36
  Bottom 0.152: v30.94,41.66 v32.18,40.42
PLD_DATA1
  Top 0.152: IC1.40 37.62,40.82 35.66,40.82 34.12,42.36 28.82,42.36 28.26,41.8 U19.37
PLD_DATA2
  Top 0.152: IC1.36 37.62,42.82 36.68,42.82 36.42,43.08 28.96,43.08 27.76,41.88 U19.38
PLD_DATA3
  Top 0.152: IC1.35 37.62,43.32 36.62,43.32 36.54,43.4 28.78,43.4 27.26,41.88 U19.39
PLD_DATA4
  Top 0.152: IC1.34 37.62,43.82 36.56,43.82 36.42,43.96 27.92,43.96 26.76,42.8 U19.40
PLD_DATA5
  Top 0.152: IC1.33 37.66,44.28 27.24,44.28 26.26,43.3 U19.41
PLD_DATA6  (via drill 0.36)
  Top 0.152: v43.98,44.4 43.8,44.58 37.88,44.58 IC1.32 | v41.56,58.98 39.38,61.16 34.82,61.16 31.38,57.72 v30.92,57.72 | v27.92,39.86 27.62,40.16 26,40.16 25.76,40.4 U19.42
  Bottom 0.152: v43.98,44.4 43.98,49.62 42.18,51.42 42.18,58.36 v41.56,58.98 | v30.92,57.72 29.6,56.4 29.6,41.54 v27.92,39.86
PLD_DATA7
  Top 0.152: IC1.31 37.62,45.08 29.72,45.08 29.24,44.6 26.92,44.6 25.26,42.94 U19.43
PLD_DATA8  (via drill 0.36)
  Top 0.152: v28.98,45.22 29.34,45.58 37.62,45.58 IC1.30 | v27.24,39.24 26.64,39.84 25.32,39.84 24.76,40.4 U19.44
  Bottom 0.152: v28.98,45.22 27.24,43.48 v27.24,39.24
PLD_DATA9  (via drill 0.36)
  Top 0.152: v24.36,44.82 25.62,46.08 37.62,46.08 IC1.29 | v24.08,42.34 24.08,41.96 24.24,41.8 U19.45
  Bottom 0.152: v24.36,44.82 24.08,44.54 v24.08,42.34
PLD_DATA10  (via drill 0.36)
  Top 0.152: v31.74,46.7 32.02,46.52 35.96,46.52 36.02,46.58 37.62,46.58 IC1.28 | v29.74,37.92 29.2,37.38 24.98,37.38 v24.36,38 | v24.3,39.86 23.76,40.4 U19.46
  Bottom 0.152: v31.74,46.7 29.92,44.58 29.92,38.1 v29.74,37.92 | v24.36,38 24.3,38.06 v24.3,39.86
PLD_DATA11  (via drill 0.36)
  Top 0.152: v32.9,47.14 33.2,46.84 35.84,46.84 36.08,47.08 37.62,47.08 IC1.27 | v32,52.44 31.7,52.14 26.14,52.14 25.54,52.74 24.4,52.74 v23.78,52.12 | v21.58,43.28 22.82,42.04 23,42.04 23.24,41.8 U19.47
  Bottom 0.152: v32.9,47.14 32,48.04 v32,52.44 | v23.78,52.12 21.58,49.92 v21.58,43.28
PLD_DATA12  (via drill 0.36)
  Top 0.152: v21.62,50.84 28.88,50.84 28.88,50.28 30.6,48.56 31.12,48.56 31.3,48.74 34.9,48.74 35.32,48.32 37.12,48.32 IC1.26 | v21.58,42 22.48,41.1 U19.48
  Bottom 0.152: v21.62,50.84 20.96,50.18 20.96,42.62 v21.58,42
PLD_DATA13  (via drill 0.36)
  Top 0.152: v17.9,50.5 18.9,51.5 37.68,51.5 38,51.18 40.5,51.18 IC1.23 | v17.82,40.1 18.04,40.32 20,40.32 20.7,39.62 U19.49
  Bottom 0.152: v17.9,50.5 17.32,49.92 17.32,40.6 v17.82,40.1
PLD_DATA14  (via drill 0.36)
  Top 0.152: v41.56,50.88 41,50.88 IC1.22 | v38.98,52.44 v41.56,52.44 | v37.42,50.88 36.8,50.26 v36.22,50.26 | v29.54,35.94 29.24,36.24 23.7,36.24 21.4,38.54 U19.50
  Bottom 0.152: v41.56,52.44 v41.56,50.88 | v37.42,50.88 v38.98,52.44 | v36.22,50.26 33.52,47.56 33.52,39.3 31.68,37.46 31.68,36.3 31.32,35.94 v29.54,35.94
PLD_DATA15  (via drill 0.36)
  Top 0.152: v40.5,48.4 41.5,48.4 IC1.21 | v39.72,53.98 24.28,53.98 22.42,52.12 v19.84,52.12 | v19.74,39.7 19.74,38.06 U19.51
  Bottom 0.152: v40.5,48.4 40.2,48.7 40.2,53.5 v39.72,53.98 | v19.84,52.12 19.7,51.98 19.7,49.34 19.42,49.06 19.42,47.28 19.74,46.96 v19.74,39.7
PLD_TCK  (via drill 0.36)
  Top 0.152: v33.54,34.56 U19.23 | v33.54,37.2 IC1.47 37.82,37.22 38.26,37.22 v41.12,40.08
  Bottom 0.152: v33.54,34.56 v33.54,37.2 | v41.12,40.08 41.12,48.66 40.94,48.84 40.94,62.08 U6.9
PLD_TDI  (via drill 0.36)
  Top 0.152: U19.21 33.54,33.56 36.56,36.58 37.62,36.58 IC1.48 37.82,36.72 38.26,36.72 38.38,36.84 43.86,36.84 v48.28,41.26
  Bottom 0.152: v48.28,41.26 48.28,42.72 50.48,44.92 50.48,58.94 51.54,60 51.54,62.54 49.52,62.54 U6.5
PLD_TDO  (via drill 0.36)
  Top 0.152: 41,32.28 41,31.98 37.58,31.98 37.02,32.54 U19.19 | 41,32.28 IC1.54 | v52.36,33.82 50.82,32.28 41,32.28
  Bottom 0.152: v52.36,33.82 52.36,58.28 52.08,58.56 52.08,62.52 U6.3
PLD_TMS  (via drill 0.36)
  Top 0.152: v39.46,32.6 39.2,32.86 33.18,32.86 33,33.04 U19.20 | IC1.49 37.88,36.32 40.64,36.32 v40.74,36.22 40.8,36.26 44.16,36.26 v45.22,37.32
  Bottom 0.152: v40.74,36.22 40.74,33.88 v39.46,32.6 | v45.22,37.32 45.14,37.4 45.14,46.82 45.22,46.9 45.22,56.78 44.46,57.54 44.46,63.06 U6.7
PLD_TRST  (via drill 0.36)
  Top 0.152: v47.08,32.9 41.5,32.9 IC1.55
  Bottom 0.152: v47.08,32.9 47.66,33.48 47.66,45.64 50.16,48.14 50.16,61.14 U6.4
UART1RX  (via drill 0.36)
  Top 0.152: v29.22,39.86 29.24,39.86 U19.35 | U19.22 31.36,34.06 31.36,35.04 v29.54,36.86 29.48,36.9 24.52,36.9 20.7,40.72 16.22,40.72 v14.34,42.6 | v14.34,52.3 12.3,54.34 7.52,54.34 7.14,53.96 2.08,53.96 1.74,53.62 U10.1
  Bottom 0.152: v29.22,39.86 29.22,38.28 29.12,38.18 29.12,37.28 v29.54,36.86 | v14.34,52.3 v14.34,42.6
UART1TX  (via drill 0.36)
  Top 0.152: v28.76,28.26 U19.13 | U19.34 29.84,41.1 29.84,39.6 29.48,39.24 28.68,39.24 v28.6,39.16 28.54,39.12 28.52,39.12 28.02,38.62 24.04,38.62 19.44,43.22 9.54,43.22 v9.46,43.3 | v7.84,51 U10.5
  Bottom 0.152: v28.76,28.26 28.6,28.42 v28.6,39.16 | v7.84,51 8.88,49.96 9.46,49.96 v9.46,43.3
USB0_DM
  Top 0.152: U7.D- 20.58,4.08 16.62,4.08 15.92,4.78 15.28,4.78 10.5,9.56 6.6,9.56 5.78,10.38 0.82,10.38 0.82,11.72 R4.1
USB0_DP  (via drill 0.36)
  Top 0.152: v10.46,14.84 2.76,14.84 R3.1 | v14.84,6.3 15.22,5.92 18.58,5.92 U7.D+
  Bottom 0.152: v10.46,14.84 14.84,10.46 v14.84,6.3
USB1_DM  (via drill 0.36)
  Top 0.152: v5.04,39.12 6.44,37.72 7.4,37.72 R14.2 | v4.58,45.8 U10.16 9.2,45.76 9.8,45.76 v11.02,44.54 | v10,33.08 8.98,32.06 7.98,32.06 U17.11
  Bottom 0.152: v5.04,39.12 4.58,39.58 v4.58,45.8 | v10,33.08 11.02,34.1 v11.02,44.54
USB1_DP  (via drill 0.36)
  Top 0.152: v6.7,38.34 6.82,38.34 R15.2 | v7.32,31.68 7.32,30.46 U17.12 | v5.24,45.16 U10.15 | v4.46,48.68 4.8,49.02 v7.84,49.02
  Bottom 0.152: v6.7,38.34 6.08,37.72 6.08,35.46 | 6.08,35.46 6.08,34.5 7.32,33.26 v7.32,31.68 | v5.24,45.16 5.2,45.2 5.2,46.54 4.46,47.28 v4.46,48.68 | v7.84,49.02 8.46,48.4 8.46,36.96 6.96,35.46 6.08,35.46
USB2_DM  (via drill 0.36)
  Top 0.152: 0.94,42.4 0.94,37.58 1.2,37.32 1.22,37.32 R7.2 | 0.94,42.4 U16.6 | v6.7,36.08 7,36.08 R12.2 | 5.08,46.42 4.26,46.42 1.34,43.5 1.08,43.5 0.94,43.36 0.94,42.4 | 5.08,46.42 v7.84,46.42 | 5.08,46.42 v5.08,47.54
  Bottom 0.152: v6.7,36.08 7.84,37.22 v7.84,46.42 | v5.08,47.54 5.08,48.94 4.58,49.44 4.58,59.82 4.26,60.14 4.26,64.24 30.26,64.24 32.38,62.12 32.38,57.12 U8.D-
USB2_DP  (via drill 0.36)
  Top 0.152: v2.46,31.84 2.42,31.84 2.42,33.34 2.04,33.72 1.06,33.72 1.06,35.12 R6.2 1.6,35.76 0.62,35.76 0.62,43.66 v1.08,44.12 | v4.84,36.7 R13.2 | v3.22,41.1 U16.8 | v29.78,57.72 U8.D+ | v14.04,62.16 11.3,59.42 7.12,59.42 v3.52,55.82
  Bottom 0.152: v2.46,31.84 2.88,32.26 2.88,34.74 v4.84,36.7 4.8,36.76 4.26,37.3 4.26,40.06 v3.22,41.1 | v29.78,57.72 29.26,58.24 29.26,59.4 26.28,62.38 14.04,62.38 v14.04,62.16 | v3.52,55.82 1.08,53.38 v1.08,44.12
USB2_VCC  (via drill 0.36)
  Top 0.152: v10.46,17.08 9.82,16.44 2.24,16.44 U18.7 | v10.86,22.52 11.02,22.68 14.64,22.68 17.34,25.38 19.7,25.38 v22.22,27.9 | v28.98,52.76 29.26,53.04 v30.86,53.04
  Bottom 0.152: C3.+ 35.26,60.74 L3.2 33.36,58.74 33.92,58.18 33.92,56.1 v30.86,53.04 | v10.46,17.08 10.86,17.48 v10.86,22.52 | v22.22,27.9 25.2,30.88 25.2,36.36 26.62,37.78 26.62,50.4 v28.98,52.76
USB3_DM  (via drill 0.36)
  Top 0.152: v1.62,40.36 1.68,40.36 R9.2 | v3.96,54.9 4.62,55.56 9.08,55.56 U9.D- | v6.7,33 7.48,33 R10.2 | v4.5,29.3 4.38,29.42 v0.94,29.42 | v10.4,42.4 9.46,42.4 9.02,42.84 8.32,42.84 8.12,43.04 U16.4
  Bottom 0.152: v3.96,54.9 1.92,52.86 1.92,40.66 v1.62,40.36 1.58,40.3 0.6,39.32 0.6,29.76 v0.94,29.42 | v6.7,33 4.5,30.8 v4.5,29.3 | v10.4,42.4 10.4,54.34 10,54.74 U9.D-
USB3_DP  (via drill 0.36)
  Top 0.152: 5.22,41.76 3.94,40.48 2.4,40.48 2.4,38.68 2.14,38.42 2.08,38.42 R8.2 | 7.14,41.76 U16.2 | 5.22,41.76 7.14,41.76 | R11.2 8.18,34.88 8.18,40.6 7.34,40.6 7.14,40.8 7.14,41.76 | 5.22,41.76 v5.2,41.82
  Bottom 0.152: v5.2,41.82 5.2,42.54 5.86,43.2 5.86,54.34 U9.D+
USB3_VCC  (via drill 0.36)
  Top 0.152: v11.48,17.82 11.28,18.02 9.78,18.02 8.86,18.94 5.98,18.94 5.84,18.8 2.1,18.8 U18.6
  Bottom 0.152: L5.2 5.8,59.12 5.8,59.54 | 5.8,59.54 C4.+ | v11.48,17.82 11.66,18 11.66,45.28 12.6,46.22 12.6,55.08 11.16,56.52 11.16,59.4 11.02,59.54 5.8,59.54
USB5V  (via drill 0.36)
  Top 0.152: v3.84,47.18 5.06,48.4 U10.20 | R1.1 1.46,31.84 v1.54,31.84 1.58,31.78 2.58,30.78 2.58,30.04 v3.12,30.04 | v16.2,1.2 16.02,1.02 14.02,1.02 10.98,4.06 10.98,4.68 C2.+ 10.96,6.44 C1.1 9.42,8.04 9.42,8.1 v8.58,8.94 | v8.42,10.18 7.52,10.18 U12.2 | v9.04,17.06 U18.2 | v4.62,24.28 5.44,23.46 v6.86,23.46
  Bottom 0.152: v1.54,31.84 2.56,32.86 2.56,42.28 3.84,43.56 v3.84,47.18 | v16.2,1.2 L1.2 | v8.58,8.94 8.58,10.02 v8.42,10.18 8.46,10.24 8.46,16.48 v9.04,17.06 9,17.12 8.06,18.06 8.06,22.26 v6.86,23.46 | v3.12,30.04 3.56,29.6 3.56,25.74 4.62,24.68 v4.62,24.28
USB_CONNECT  (via drill 0.36)
  Top 0.152: R2.1 3.14,33.1 R1.2 3.18,32.86 3.88,32.16 v3.88,31.62 | v25.28,52.12 25.58,51.82 37.8,51.82 38.12,51.5 42.18,51.5 42.18,50.62 42,50.44 IC1.20 | v20.98,27.9 18.78,25.7 U17.4 11.06,25.72 4.78,25.72 v4.62,25.88 | v7.84,47.52 8.92,47.52 U10.19 | v7.22,44.54 7.84,43.92 v24.92,43.92
  Bottom 0.152: v25.28,52.12 24.98,51.82 24.98,43.92 | 24.98,43.92 24.98,36.58 23.14,34.74 23.14,32.54 20.98,30.38 v20.98,27.9 | v7.84,47.52 7.22,46.9 v7.22,44.54 | 24.98,43.92 v24.92,43.92 | v3.88,31.62 3.88,26.62 v4.62,25.88
VOUTA  (via drill 0.36)
  Top 0.152: v19.74,3.02 21.74,1.02 26.98,1.02 28.22,2.26 42.82,2.26 R23.1 | v16.36,15.28 16.56,15.48 24.34,15.48
  Top 0.2: U22.13 24.34,15.48 24.34,17.15 R27.1
  Bottom 0.152: v19.74,3.02 18.68,4.08 16.28,4.08 16.28,4.42 16.08,4.62 16.08,15 v16.36,15.28
VOUTB  (via drill 0.36)
  Top 0.152: v36.28,1.64 37.12,1.64 R26.1 | v30.6,21.38 30.42,21.2 29.16,21.2 27.84,19.88 v27.84,19 | v25.94,17.1 26.84,17.1 R28.1
  Top 0.2: U22.9 R28.1
  Bottom 0.152: v36.28,1.64 36.16,1.76 36.16,16.94 31.72,21.38 v30.6,21.38 | v27.84,19 v25.94,17.1
VPUMP  (via drill 0.36)
  Top 0.152: v36.78,33.48 37.04,33.22 40,33.22 IC1.52 | v35.68,25.32 36.8,24.2 40.94,24.2 40.96,24.18 49.76,24.18 54.16,28.58 54.16,60.52 46.46,60.52 U6.8
  Bottom 0.152: v36.78,33.48 35.34,32.04 33.62,32.04 33.62,27.38 v35.68,25.32
VREF+
  Top 0.152: C13.+ 15.84,29.16 17.7,29.16 C14.1 18.44,28.52 25.74,28.52 U19.7
VREFA  (via drill 0.36)
  Top 0.152: R18.2 R19.2 16.9,49.72 17.04,49.72 v17.94,48.82 | v18.44,35.12 19.9,33.66 20.6,33.66 U19.60
  Bottom 0.152: v18.44,35.12 18.44,48.32 v17.94,48.82
VREFB  (via drill 0.36)
  Top 0.152: R21.2 R20.2 19.08,49.82 v19.08,50.8 | v17.24,34.88 18.96,33.16 20.6,33.16 U19.61
  Bottom 0.152: v17.24,34.88 17,35.12 17,50.48 17.64,51.12 19.08,51.12 v19.08,50.8

### Text on the board
tNames: TDBRevD